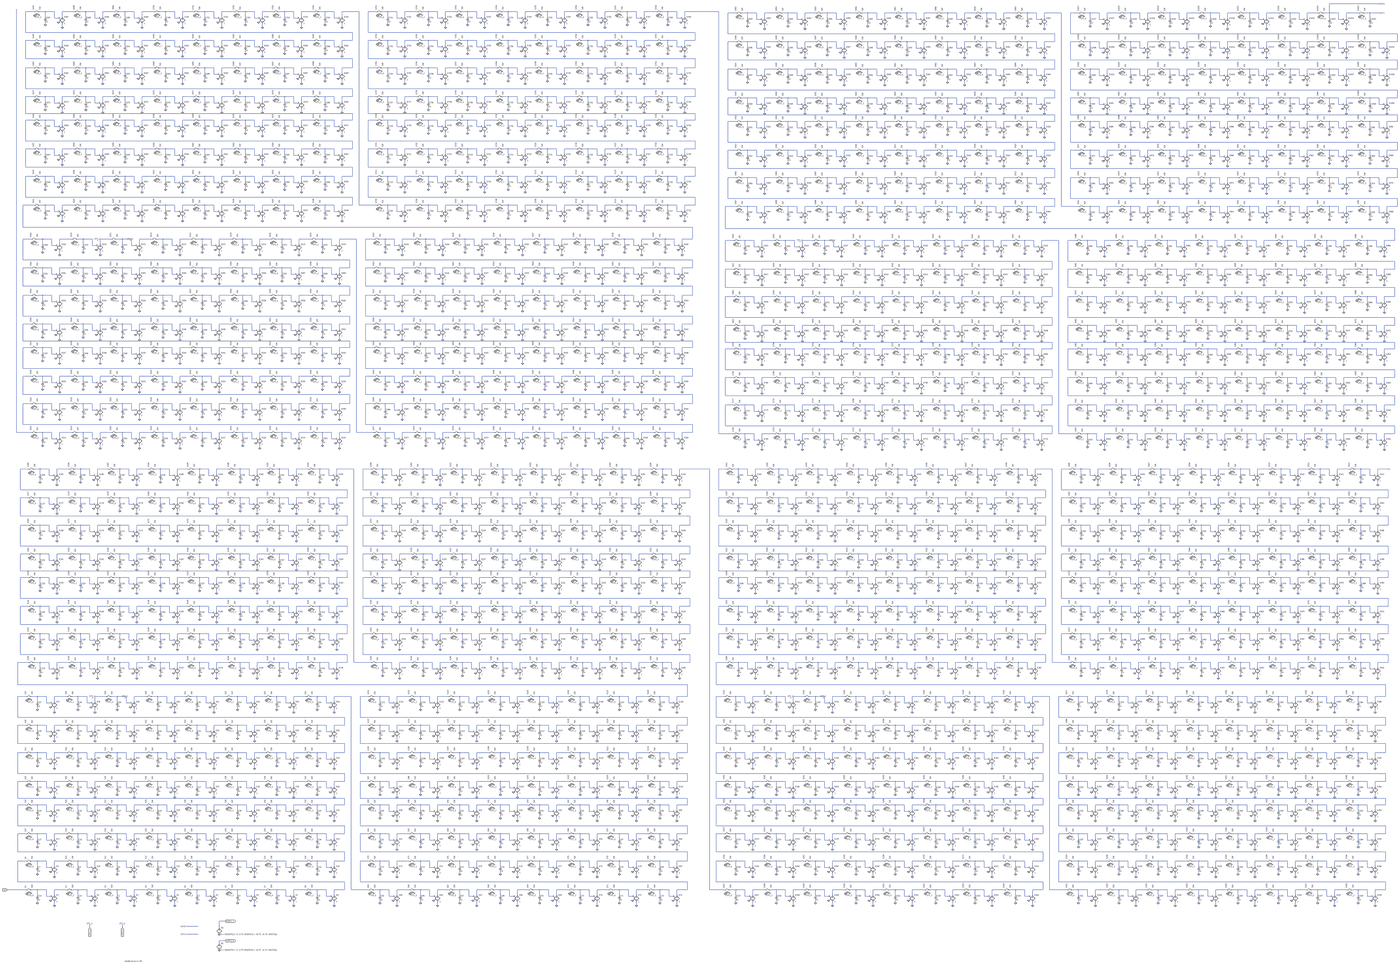
[diagram p0: schematic CHEAP BBD.asc, whole sheet]
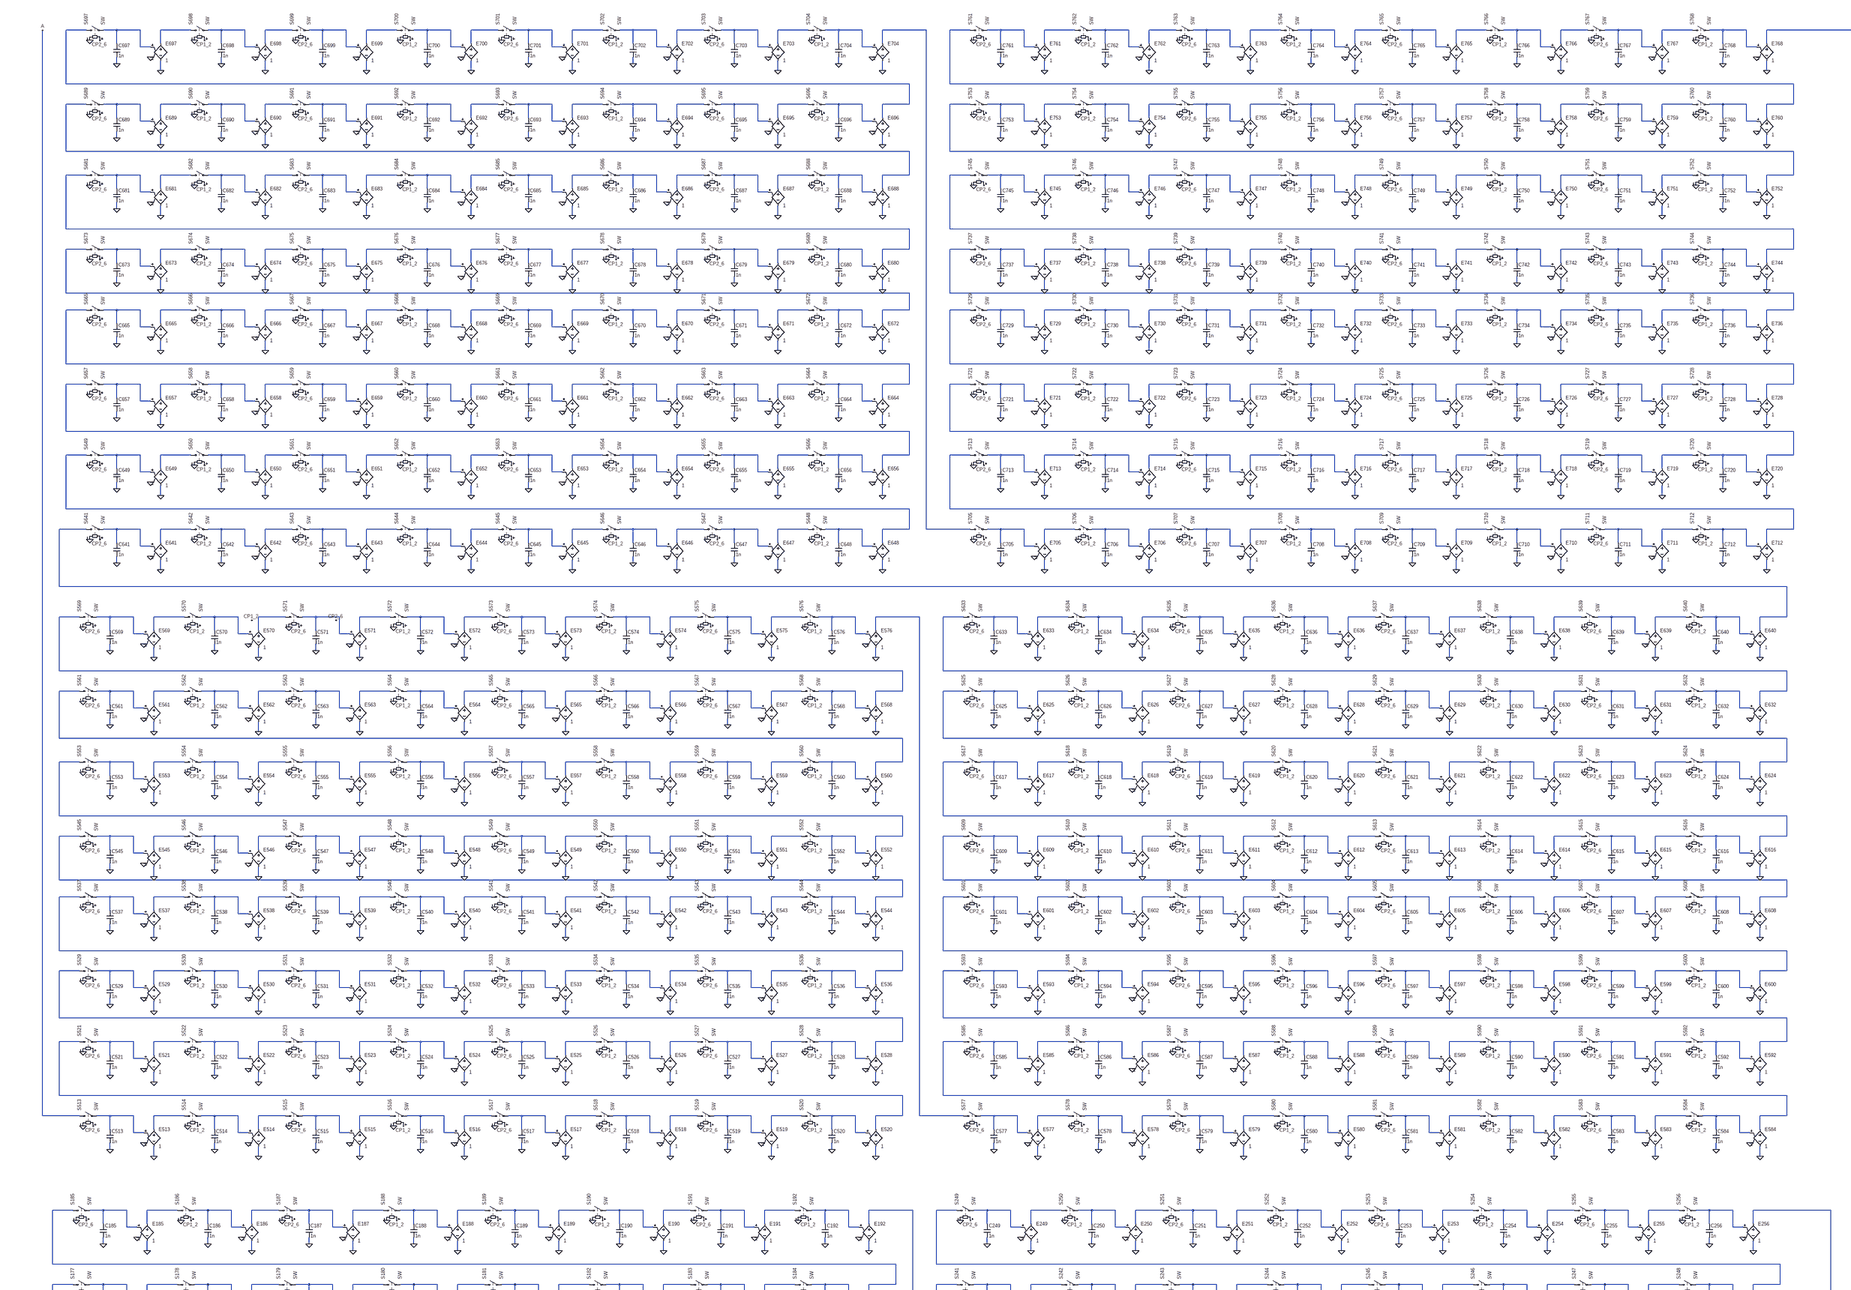
[diagram p1: schematic CHEAP BBD.asc, part, row 1 of 2, column 1 of 2]
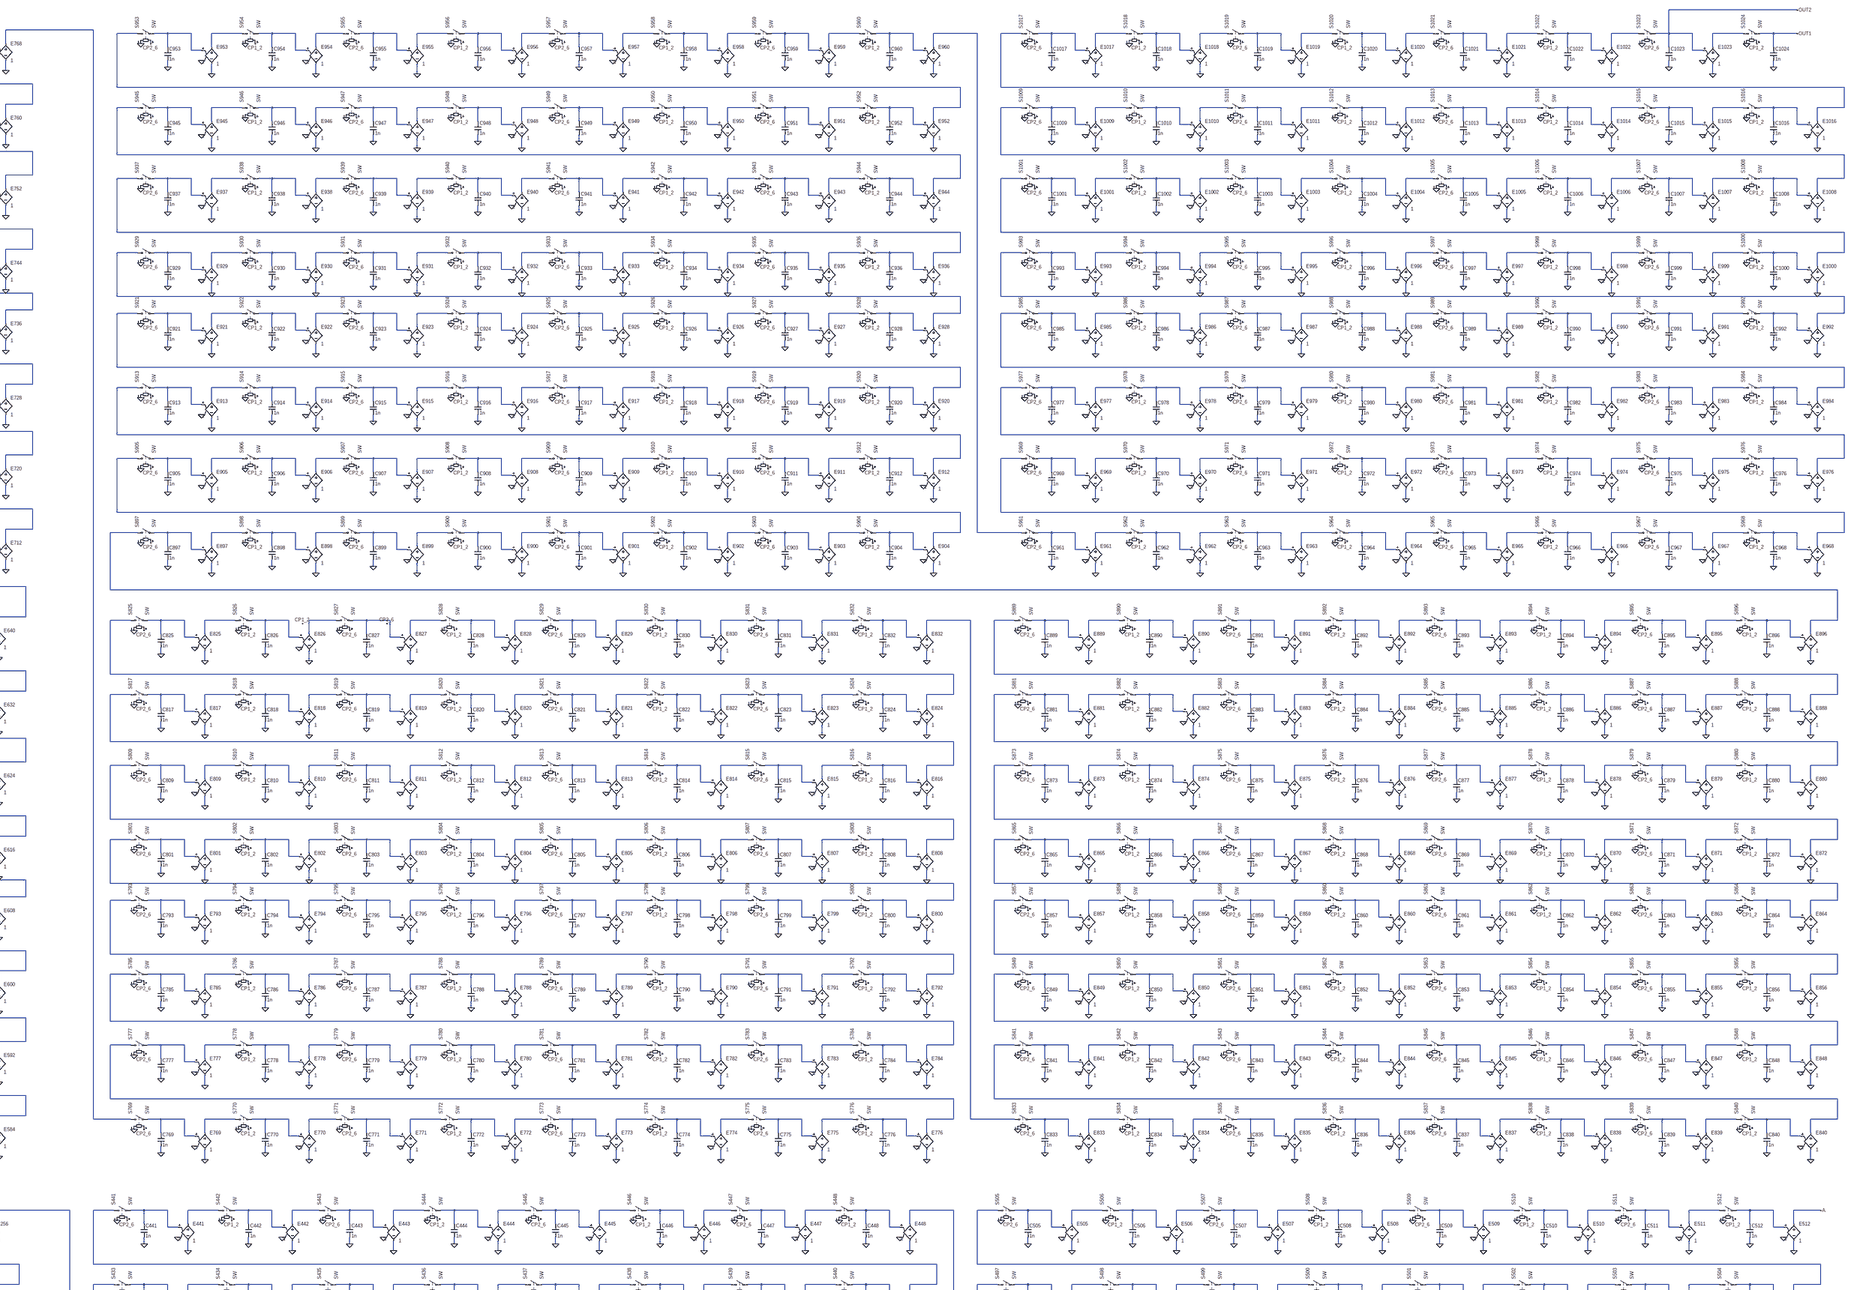
[diagram p2: schematic CHEAP BBD.asc, part, row 1 of 2, column 2 of 2]
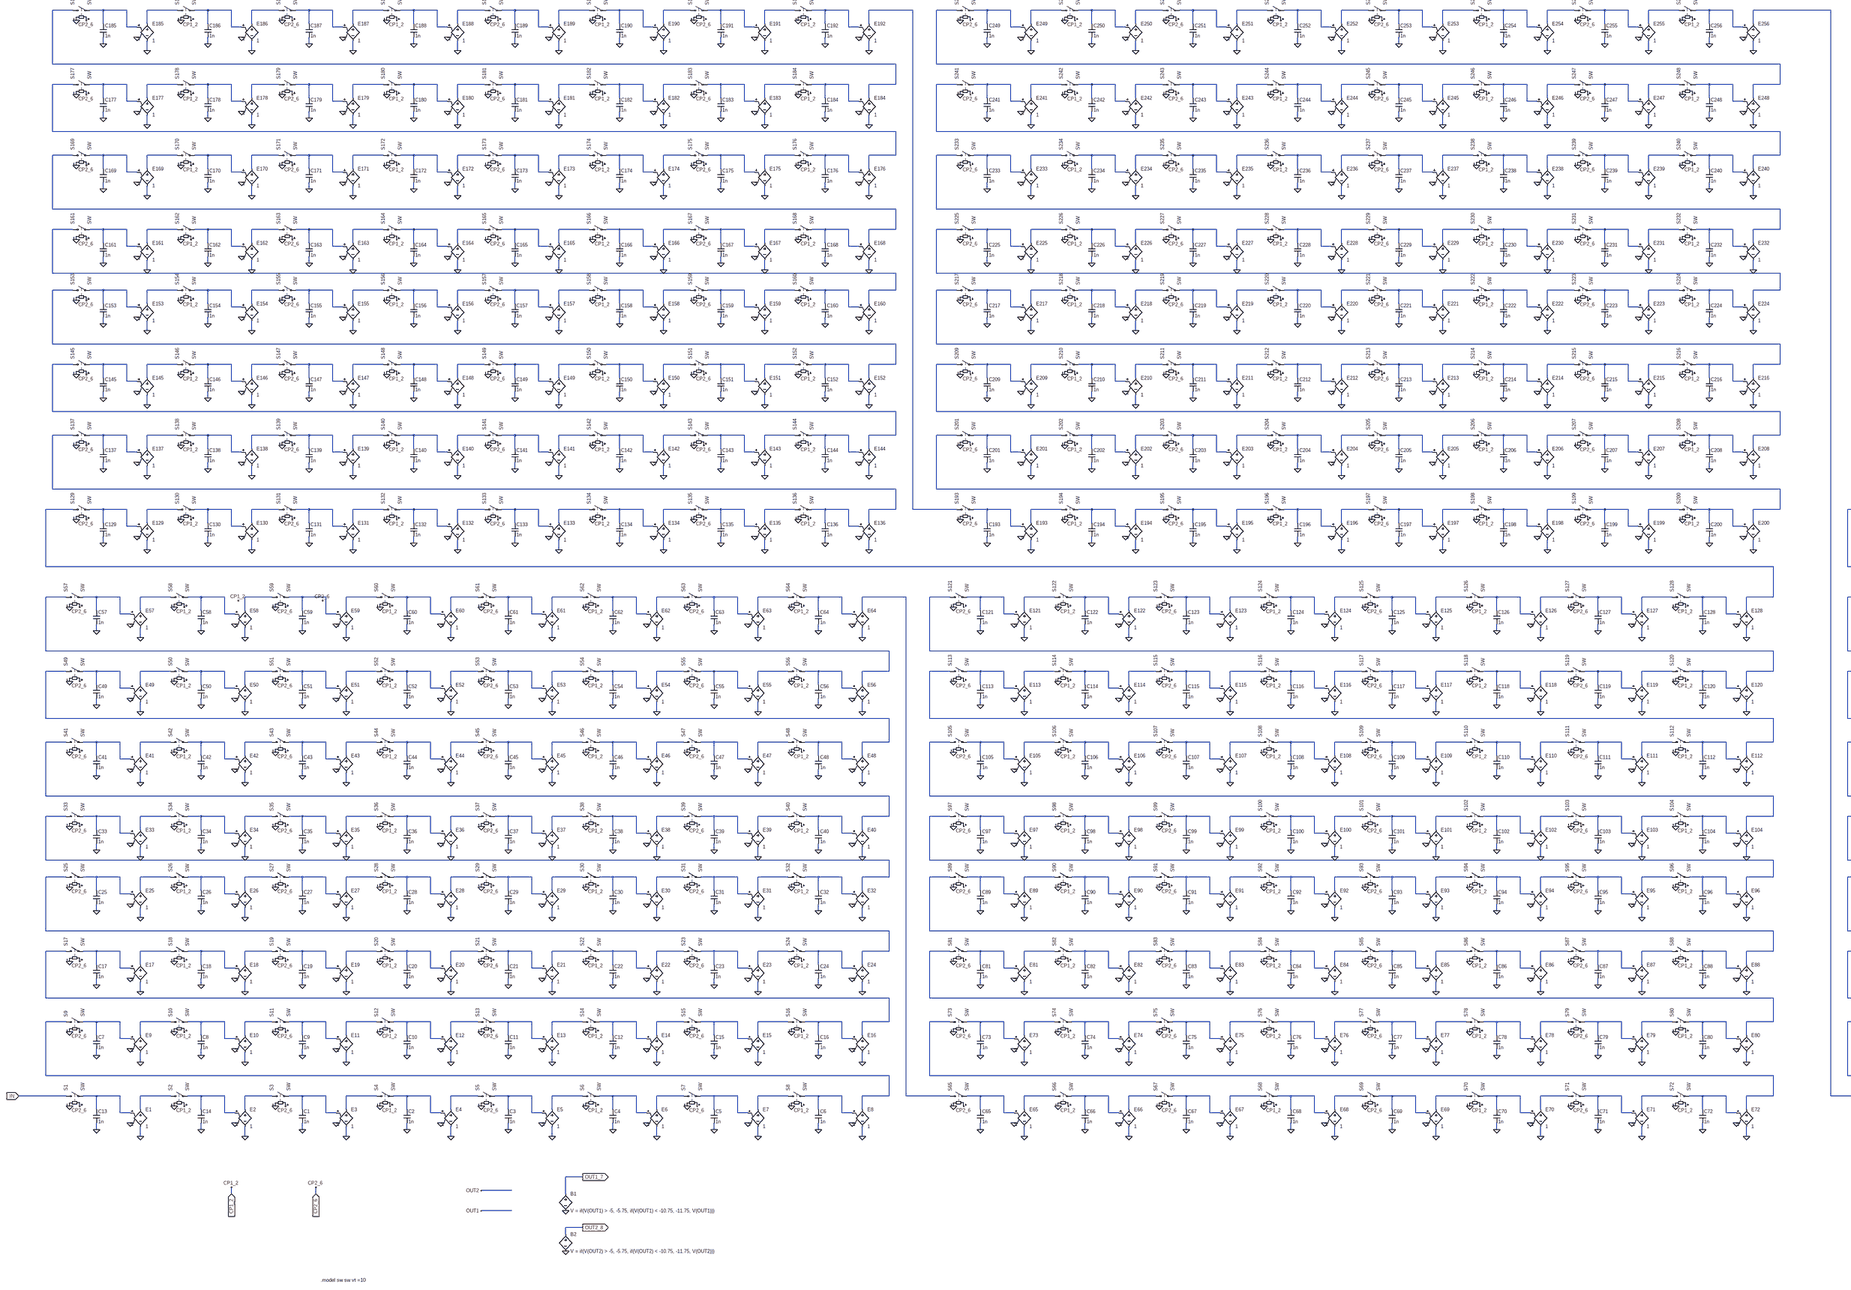
[diagram p3: schematic CHEAP BBD.asc, part, row 2 of 2, column 1 of 2]
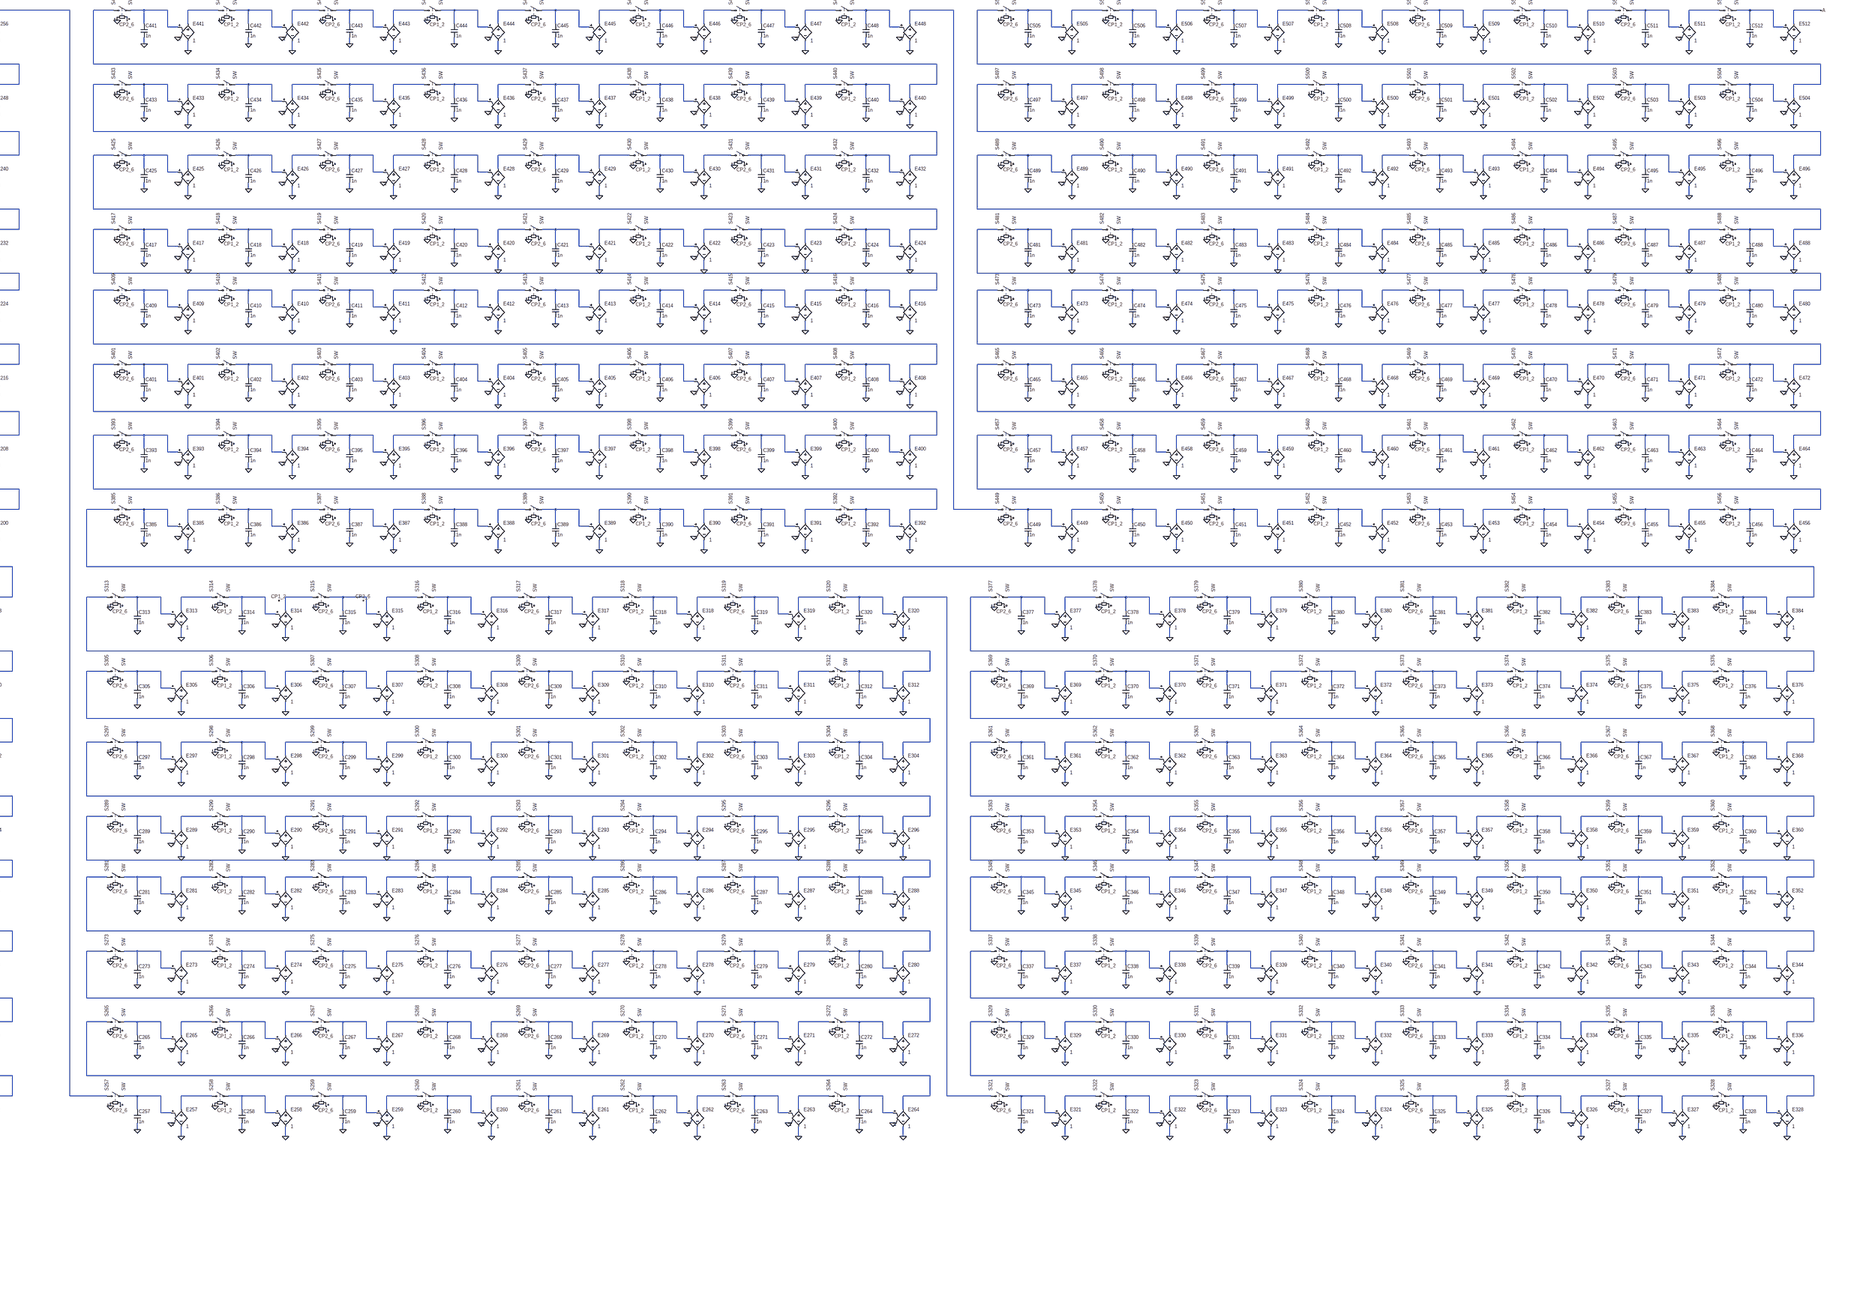
[diagram p4: schematic CHEAP BBD.asc, part, row 2 of 2, column 2 of 2]
* CHEAP BBD.asc
S1 IN N1985 CP2_6 0 SW
C13 N1985 0 1n
S2 N1986 N1987 CP1_2 0 SW
C14 N1987 0 1n
E1 N1986 0 N1985 0 1
E2 N1988 0 N1987 0 1
S3 N1988 N1989 CP2_6 0 SW
C1 N1989 0 1n
S4 N1990 N1991 CP1_2 0 SW
C2 N1991 0 1n
E3 N1990 0 N1989 0 1
E4 N1992 0 N1991 0 1
S5 N1992 N1993 CP2_6 0 SW
C3 N1993 0 1n
S6 N1994 N1995 CP1_2 0 SW
C4 N1995 0 1n
E5 N1994 0 N1993 0 1
E6 N1996 0 N1995 0 1
S7 N1996 N1997 CP2_6 0 SW
C5 N1997 0 1n
S8 N1998 N1999 CP1_2 0 SW
C6 N1999 0 1n
E7 N1998 0 N1997 0 1
E8 N1921 0 N1999 0 1
S9 N1921 N1922 CP2_6 0 SW
C7 N1922 0 1n
S10 N1923 N1924 CP1_2 0 SW
C8 N1924 0 1n
E9 N1923 0 N1922 0 1
E10 N1925 0 N1924 0 1
S11 N1925 N1926 CP2_6 0 SW
C9 N1926 0 1n
S12 N1927 N1928 CP1_2 0 SW
C10 N1928 0 1n
E11 N1927 0 N1926 0 1
E12 N1929 0 N1928 0 1
S13 N1929 N1930 CP2_6 0 SW
C11 N1930 0 1n
S14 N1931 N1932 CP1_2 0 SW
C12 N1932 0 1n
E13 N1931 0 N1930 0 1
E14 N1933 0 N1932 0 1
S15 N1933 N1934 CP2_6 0 SW
C15 N1934 0 1n
S16 N1935 N1936 CP1_2 0 SW
C16 N1936 0 1n
E15 N1935 0 N1934 0 1
E16 N1857 0 N1936 0 1
S17 N1857 N1858 CP2_6 0 SW
C17 N1858 0 1n
S18 N1859 N1860 CP1_2 0 SW
C18 N1860 0 1n
E17 N1859 0 N1858 0 1
E18 N1861 0 N1860 0 1
S19 N1861 N1862 CP2_6 0 SW
C19 N1862 0 1n
S20 N1863 N1864 CP1_2 0 SW
C20 N1864 0 1n
E19 N1863 0 N1862 0 1
E20 N1865 0 N1864 0 1
S21 N1865 N1866 CP2_6 0 SW
C21 N1866 0 1n
S22 N1867 N1868 CP1_2 0 SW
C22 N1868 0 1n
E21 N1867 0 N1866 0 1
E22 N1869 0 N1868 0 1
S23 N1869 N1870 CP2_6 0 SW
C23 N1870 0 1n
S24 N1871 N1872 CP1_2 0 SW
C24 N1872 0 1n
E23 N1871 0 N1870 0 1
E24 N1793 0 N1872 0 1
S25 N1793 N1794 CP2_6 0 SW
C25 N1794 0 1n
S26 N1795 N1796 CP1_2 0 SW
C26 N1796 0 1n
E25 N1795 0 N1794 0 1
E26 N1797 0 N1796 0 1
S27 N1797 N1798 CP2_6 0 SW
C27 N1798 0 1n
S28 N1799 N1800 CP1_2 0 SW
C28 N1800 0 1n
E27 N1799 0 N1798 0 1
E28 N1801 0 N1800 0 1
S29 N1801 N1802 CP2_6 0 SW
C29 N1802 0 1n
S30 N1803 N1804 CP1_2 0 SW
C30 N1804 0 1n
E29 N1803 0 N1802 0 1
E30 N1805 0 N1804 0 1
S31 N1805 N1806 CP2_6 0 SW
C31 N1806 0 1n
S32 N1807 N1808 CP1_2 0 SW
C32 N1808 0 1n
E31 N1807 0 N1806 0 1
E32 N1729 0 N1808 0 1
S33 N1729 N1730 CP2_6 0 SW
C33 N1730 0 1n
S34 N1731 N1732 CP1_2 0 SW
C34 N1732 0 1n
E33 N1731 0 N1730 0 1
E34 N1733 0 N1732 0 1
S35 N1733 N1734 CP2_6 0 SW
C35 N1734 0 1n
S36 N1735 N1736 CP1_2 0 SW
C36 N1736 0 1n
E35 N1735 0 N1734 0 1
E36 N1737 0 N1736 0 1
S37 N1737 N1738 CP2_6 0 SW
C37 N1738 0 1n
S38 N1739 N1740 CP1_2 0 SW
C38 N1740 0 1n
E37 N1739 0 N1738 0 1
E38 N1741 0 N1740 0 1
S39 N1741 N1742 CP2_6 0 SW
C39 N1742 0 1n
S40 N1743 N1744 CP1_2 0 SW
C40 N1744 0 1n
E39 N1743 0 N1742 0 1
E40 N1665 0 N1744 0 1
S41 N1665 N1666 CP2_6 0 SW
C41 N1666 0 1n
S42 N1667 N1668 CP1_2 0 SW
C42 N1668 0 1n
E41 N1667 0 N1666 0 1
E42 N1669 0 N1668 0 1
S43 N1669 N1670 CP2_6 0 SW
C43 N1670 0 1n
S44 N1671 N1672 CP1_2 0 SW
C44 N1672 0 1n
E43 N1671 0 N1670 0 1
E44 N1673 0 N1672 0 1
S45 N1673 N1674 CP2_6 0 SW
C45 N1674 0 1n
S46 N1675 N1676 CP1_2 0 SW
C46 N1676 0 1n
E45 N1675 0 N1674 0 1
E46 N1677 0 N1676 0 1
S47 N1677 N1678 CP2_6 0 SW
C47 N1678 0 1n
S48 N1679 N1680 CP1_2 0 SW
C48 N1680 0 1n
E47 N1679 0 N1678 0 1
E48 N1601 0 N1680 0 1
S49 N1601 N1602 CP2_6 0 SW
C49 N1602 0 1n
S50 N1603 N1604 CP1_2 0 SW
C50 N1604 0 1n
E49 N1603 0 N1602 0 1
E50 N1605 0 N1604 0 1
S51 N1605 N1606 CP2_6 0 SW
C51 N1606 0 1n
S52 N1607 N1608 CP1_2 0 SW
C52 N1608 0 1n
E51 N1607 0 N1606 0 1
E52 N1609 0 N1608 0 1
S53 N1609 N1610 CP2_6 0 SW
C53 N1610 0 1n
S54 N1611 N1612 CP1_2 0 SW
C54 N1612 0 1n
E53 N1611 0 N1610 0 1
E54 N1613 0 N1612 0 1
S55 N1613 N1614 CP2_6 0 SW
C55 N1614 0 1n
S56 N1615 N1616 CP1_2 0 SW
C56 N1616 0 1n
E55 N1615 0 N1614 0 1
E56 N1535 0 N1616 0 1
S57 N1535 N1536 CP2_6 0 SW
C57 N1536 0 1n
S58 N1537 N1538 CP1_2 0 SW
C58 N1538 0 1n
E57 N1537 0 N1536 0 1
E58 N1539 0 N1538 0 1
S59 N1539 N1540 CP2_6 0 SW
C59 N1540 0 1n
S60 N1541 N1542 CP1_2 0 SW
C60 N1542 0 1n
E59 N1541 0 N1540 0 1
E60 N1543 0 N1542 0 1
S61 N1543 N1544 CP2_6 0 SW
C61 N1544 0 1n
S62 N1545 N1546 CP1_2 0 SW
C62 N1546 0 1n
E61 N1545 0 N1544 0 1
E62 N1547 0 N1546 0 1
S63 N1547 N1548 CP2_6 0 SW
C63 N1548 0 1n
S64 N1549 N1550 CP1_2 0 SW
C64 N1550 0 1n
E63 N1549 0 N1548 0 1
E64 N1551 0 N1550 0 1
S65 N1551 N2000 CP2_6 0 SW
C65 N2000 0 1n
S66 N2001 N2002 CP1_2 0 SW
C66 N2002 0 1n
E65 N2001 0 N2000 0 1
E66 N2003 0 N2002 0 1
S67 N2003 N2004 CP2_6 0 SW
C67 N2004 0 1n
S68 N2005 N2006 CP1_2 0 SW
C68 N2006 0 1n
E67 N2005 0 N2004 0 1
E68 N2007 0 N2006 0 1
S69 N2007 N2008 CP2_6 0 SW
C69 N2008 0 1n
S70 N2009 N2010 CP1_2 0 SW
C70 N2010 0 1n
E69 N2009 0 N2008 0 1
E70 N2011 0 N2010 0 1
S71 N2011 N2012 CP2_6 0 SW
C71 N2012 0 1n
S72 N2013 N2014 CP1_2 0 SW
C72 N2014 0 1n
E71 N2013 0 N2012 0 1
E72 N1937 0 N2014 0 1
S73 N1937 N1938 CP2_6 0 SW
C73 N1938 0 1n
S74 N1939 N1940 CP1_2 0 SW
C74 N1940 0 1n
E73 N1939 0 N1938 0 1
E74 N1941 0 N1940 0 1
S75 N1941 N1942 CP2_6 0 SW
C75 N1942 0 1n
S76 N1943 N1944 CP1_2 0 SW
C76 N1944 0 1n
E75 N1943 0 N1942 0 1
E76 N1945 0 N1944 0 1
S77 N1945 N1946 CP2_6 0 SW
C77 N1946 0 1n
S78 N1947 N1948 CP1_2 0 SW
C78 N1948 0 1n
E77 N1947 0 N1946 0 1
E78 N1949 0 N1948 0 1
S79 N1949 N1950 CP2_6 0 SW
C79 N1950 0 1n
S80 N1951 N1952 CP1_2 0 SW
C80 N1952 0 1n
E79 N1951 0 N1950 0 1
E80 N1873 0 N1952 0 1
S81 N1873 N1874 CP2_6 0 SW
C81 N1874 0 1n
S82 N1875 N1876 CP1_2 0 SW
C82 N1876 0 1n
E81 N1875 0 N1874 0 1
E82 N1877 0 N1876 0 1
S83 N1877 N1878 CP2_6 0 SW
C83 N1878 0 1n
S84 N1879 N1880 CP1_2 0 SW
C84 N1880 0 1n
E83 N1879 0 N1878 0 1
E84 N1881 0 N1880 0 1
S85 N1881 N1882 CP2_6 0 SW
C85 N1882 0 1n
S86 N1883 N1884 CP1_2 0 SW
C86 N1884 0 1n
E85 N1883 0 N1882 0 1
E86 N1885 0 N1884 0 1
S87 N1885 N1886 CP2_6 0 SW
C87 N1886 0 1n
S88 N1887 N1888 CP1_2 0 SW
C88 N1888 0 1n
E87 N1887 0 N1886 0 1
E88 N1809 0 N1888 0 1
S89 N1809 N1810 CP2_6 0 SW
C89 N1810 0 1n
S90 N1811 N1812 CP1_2 0 SW
C90 N1812 0 1n
E89 N1811 0 N1810 0 1
E90 N1813 0 N1812 0 1
S91 N1813 N1814 CP2_6 0 SW
C91 N1814 0 1n
S92 N1815 N1816 CP1_2 0 SW
C92 N1816 0 1n
E91 N1815 0 N1814 0 1
E92 N1817 0 N1816 0 1
S93 N1817 N1818 CP2_6 0 SW
C93 N1818 0 1n
S94 N1819 N1820 CP1_2 0 SW
C94 N1820 0 1n
E93 N1819 0 N1818 0 1
E94 N1821 0 N1820 0 1
S95 N1821 N1822 CP2_6 0 SW
C95 N1822 0 1n
S96 N1823 N1824 CP1_2 0 SW
C96 N1824 0 1n
E95 N1823 0 N1822 0 1
E96 N1745 0 N1824 0 1
S97 N1745 N1746 CP2_6 0 SW
C97 N1746 0 1n
S98 N1747 N1748 CP1_2 0 SW
C98 N1748 0 1n
E97 N1747 0 N1746 0 1
E98 N1749 0 N1748 0 1
S99 N1749 N1750 CP2_6 0 SW
C99 N1750 0 1n
S100 N1751 N1752 CP1_2 0 SW
C100 N1752 0 1n
E99 N1751 0 N1750 0 1
E100 N1753 0 N1752 0 1
S101 N1753 N1754 CP2_6 0 SW
C101 N1754 0 1n
S102 N1755 N1756 CP1_2 0 SW
C102 N1756 0 1n
E101 N1755 0 N1754 0 1
E102 N1757 0 N1756 0 1
S103 N1757 N1758 CP2_6 0 SW
C103 N1758 0 1n
S104 N1759 N1760 CP1_2 0 SW
C104 N1760 0 1n
E103 N1759 0 N1758 0 1
E104 N1681 0 N1760 0 1
S105 N1681 N1682 CP2_6 0 SW
C105 N1682 0 1n
S106 N1683 N1684 CP1_2 0 SW
C106 N1684 0 1n
E105 N1683 0 N1682 0 1
E106 N1685 0 N1684 0 1
S107 N1685 N1686 CP2_6 0 SW
C107 N1686 0 1n
S108 N1687 N1688 CP1_2 0 SW
C108 N1688 0 1n
E107 N1687 0 N1686 0 1
E108 N1689 0 N1688 0 1
S109 N1689 N1690 CP2_6 0 SW
C109 N1690 0 1n
S110 N1691 N1692 CP1_2 0 SW
C110 N1692 0 1n
E109 N1691 0 N1690 0 1
E110 N1693 0 N1692 0 1
S111 N1693 N1694 CP2_6 0 SW
C111 N1694 0 1n
S112 N1695 N1696 CP1_2 0 SW
C112 N1696 0 1n
E111 N1695 0 N1694 0 1
E112 N1617 0 N1696 0 1
S113 N1617 N1618 CP2_6 0 SW
C113 N1618 0 1n
S114 N1619 N1620 CP1_2 0 SW
C114 N1620 0 1n
E113 N1619 0 N1618 0 1
E114 N1621 0 N1620 0 1
S115 N1621 N1622 CP2_6 0 SW
C115 N1622 0 1n
S116 N1623 N1624 CP1_2 0 SW
C116 N1624 0 1n
E115 N1623 0 N1622 0 1
E116 N1625 0 N1624 0 1
S117 N1625 N1626 CP2_6 0 SW
C117 N1626 0 1n
S118 N1627 N1628 CP1_2 0 SW
C118 N1628 0 1n
E117 N1627 0 N1626 0 1
E118 N1629 0 N1628 0 1
S119 N1629 N1630 CP2_6 0 SW
C119 N1630 0 1n
S120 N1631 N1632 CP1_2 0 SW
C120 N1632 0 1n
E119 N1631 0 N1630 0 1
E120 N1552 0 N1632 0 1
S121 N1552 N1553 CP2_6 0 SW
C121 N1553 0 1n
S122 N1554 N1555 CP1_2 0 SW
C122 N1555 0 1n
E121 N1554 0 N1553 0 1
E122 N1556 0 N1555 0 1
S123 N1556 N1557 CP2_6 0 SW
C123 N1557 0 1n
S124 N1558 N1559 CP1_2 0 SW
C124 N1559 0 1n
E123 N1558 0 N1557 0 1
E124 N1560 0 N1559 0 1
S125 N1560 N1561 CP2_6 0 SW
C125 N1561 0 1n
S126 N1562 N1563 CP1_2 0 SW
C126 N1563 0 1n
E125 N1562 0 N1561 0 1
E126 N1564 0 N1563 0 1
S127 N1564 N1565 CP2_6 0 SW
C127 N1565 0 1n
S128 N1566 N1567 CP1_2 0 SW
C128 N1567 0 1n
E127 N1566 0 N1565 0 1
E128 N1473 0 N1567 0 1
S129 N1473 N1474 CP2_6 0 SW
C129 N1474 0 1n
S130 N1475 N1476 CP1_2 0 SW
C130 N1476 0 1n
E129 N1475 0 N1474 0 1
E130 N1477 0 N1476 0 1
S131 N1477 N1478 CP2_6 0 SW
C131 N1478 0 1n
S132 N1479 N1480 CP1_2 0 SW
C132 N1480 0 1n
E131 N1479 0 N1478 0 1
E132 N1481 0 N1480 0 1
S133 N1481 N1482 CP2_6 0 SW
C133 N1482 0 1n
S134 N1483 N1484 CP1_2 0 SW
C134 N1484 0 1n
E133 N1483 0 N1482 0 1
E134 N1485 0 N1484 0 1
S135 N1485 N1486 CP2_6 0 SW
C135 N1486 0 1n
S136 N1487 N1488 CP1_2 0 SW
C136 N1488 0 1n
E135 N1487 0 N1486 0 1
E136 N1409 0 N1488 0 1
S137 N1409 N1410 CP2_6 0 SW
C137 N1410 0 1n
S138 N1411 N1412 CP1_2 0 SW
C138 N1412 0 1n
E137 N1411 0 N1410 0 1
E138 N1413 0 N1412 0 1
S139 N1413 N1414 CP2_6 0 SW
C139 N1414 0 1n
S140 N1415 N1416 CP1_2 0 SW
C140 N1416 0 1n
E139 N1415 0 N1414 0 1
E140 N1417 0 N1416 0 1
S141 N1417 N1418 CP2_6 0 SW
C141 N1418 0 1n
S142 N1419 N1420 CP1_2 0 SW
C142 N1420 0 1n
E141 N1419 0 N1418 0 1
E142 N1421 0 N1420 0 1
S143 N1421 N1422 CP2_6 0 SW
C143 N1422 0 1n
S144 N1423 N1424 CP1_2 0 SW
C144 N1424 0 1n
E143 N1423 0 N1422 0 1
E144 N1345 0 N1424 0 1
S145 N1345 N1346 CP2_6 0 SW
C145 N1346 0 1n
S146 N1347 N1348 CP1_2 0 SW
C146 N1348 0 1n
E145 N1347 0 N1346 0 1
E146 N1349 0 N1348 0 1
S147 N1349 N1350 CP2_6 0 SW
C147 N1350 0 1n
S148 N1351 N1352 CP1_2 0 SW
C148 N1352 0 1n
E147 N1351 0 N1350 0 1
E148 N1353 0 N1352 0 1
S149 N1353 N1354 CP2_6 0 SW
C149 N1354 0 1n
S150 N1355 N1356 CP1_2 0 SW
C150 N1356 0 1n
E149 N1355 0 N1354 0 1
E150 N1357 0 N1356 0 1
S151 N1357 N1358 CP2_6 0 SW
C151 N1358 0 1n
S152 N1359 N1360 CP1_2 0 SW
C152 N1360 0 1n
E151 N1359 0 N1358 0 1
E152 N1281 0 N1360 0 1
S153 N1281 N1282 CP2_6 0 SW
C153 N1282 0 1n
S154 N1283 N1284 CP1_2 0 SW
C154 N1284 0 1n
E153 N1283 0 N1282 0 1
E154 N1285 0 N1284 0 1
S155 N1285 N1286 CP2_6 0 SW
C155 N1286 0 1n
S156 N1287 N1288 CP1_2 0 SW
C156 N1288 0 1n
E155 N1287 0 N1286 0 1
E156 N1289 0 N1288 0 1
S157 N1289 N1290 CP2_6 0 SW
C157 N1290 0 1n
S158 N1291 N1292 CP1_2 0 SW
C158 N1292 0 1n
E157 N1291 0 N1290 0 1
E158 N1293 0 N1292 0 1
S159 N1293 N1294 CP2_6 0 SW
C159 N1294 0 1n
S160 N1295 N1296 CP1_2 0 SW
C160 N1296 0 1n
E159 N1295 0 N1294 0 1
E160 N1217 0 N1296 0 1
S161 N1217 N1218 CP2_6 0 SW
C161 N1218 0 1n
S162 N1219 N1220 CP1_2 0 SW
C162 N1220 0 1n
E161 N1219 0 N1218 0 1
E162 N1221 0 N1220 0 1
S163 N1221 N1222 CP2_6 0 SW
C163 N1222 0 1n
S164 N1223 N1224 CP1_2 0 SW
C164 N1224 0 1n
E163 N1223 0 N1222 0 1
E164 N1225 0 N1224 0 1
S165 N1225 N1226 CP2_6 0 SW
C165 N1226 0 1n
S166 N1227 N1228 CP1_2 0 SW
C166 N1228 0 1n
E165 N1227 0 N1226 0 1
E166 N1229 0 N1228 0 1
S167 N1229 N1230 CP2_6 0 SW
C167 N1230 0 1n
S168 N1231 N1232 CP1_2 0 SW
C168 N1232 0 1n
E167 N1231 0 N1230 0 1
E168 N1153 0 N1232 0 1
S169 N1153 N1154 CP2_6 0 SW
C169 N1154 0 1n
S170 N1155 N1156 CP1_2 0 SW
C170 N1156 0 1n
E169 N1155 0 N1154 0 1
E170 N1157 0 N1156 0 1
S171 N1157 N1158 CP2_6 0 SW
C171 N1158 0 1n
S172 N1159 N1160 CP1_2 0 SW
C172 N1160 0 1n
E171 N1159 0 N1158 0 1
E172 N1161 0 N1160 0 1
S173 N1161 N1162 CP2_6 0 SW
C173 N1162 0 1n
S174 N1163 N1164 CP1_2 0 SW
C174 N1164 0 1n
E173 N1163 0 N1162 0 1
E174 N1165 0 N1164 0 1
S175 N1165 N1166 CP2_6 0 SW
C175 N1166 0 1n
S176 N1167 N1168 CP1_2 0 SW
C176 N1168 0 1n
E175 N1167 0 N1166 0 1
E176 N1089 0 N1168 0 1
S177 N1089 N1090 CP2_6 0 SW
C177 N1090 0 1n
S178 N1091 N1092 CP1_2 0 SW
C178 N1092 0 1n
E177 N1091 0 N1090 0 1
E178 N1093 0 N1092 0 1
S179 N1093 N1094 CP2_6 0 SW
C179 N1094 0 1n
S180 N1095 N1096 CP1_2 0 SW
C180 N1096 0 1n
E179 N1095 0 N1094 0 1
E180 N1097 0 N1096 0 1
S181 N1097 N1098 CP2_6 0 SW
C181 N1098 0 1n
S182 N1099 N1100 CP1_2 0 SW
C182 N1100 0 1n
E181 N1099 0 N1098 0 1
E182 N1101 0 N1100 0 1
S183 N1101 N1102 CP2_6 0 SW
C183 N1102 0 1n
S184 N1103 N1104 CP1_2 0 SW
C184 N1104 0 1n
E183 N1103 0 N1102 0 1
E184 N1022 0 N1104 0 1
S185 N1022 N1023 CP2_6 0 SW
C185 N1023 0 1n
S186 N1024 N1025 CP1_2 0 SW
C186 N1025 0 1n
E185 N1024 0 N1023 0 1
E186 N1026 0 N1025 0 1
S187 N1026 N1027 CP2_6 0 SW
C187 N1027 0 1n
S188 N1028 N1029 CP1_2 0 SW
C188 N1029 0 1n
E187 N1028 0 N1027 0 1
E188 N1030 0 N1029 0 1
S189 N1030 N1031 CP2_6 0 SW
C189 N1031 0 1n
S190 N1032 N1033 CP1_2 0 SW
C190 N1033 0 1n
E189 N1032 0 N1031 0 1
E190 N1034 0 N1033 0 1
S191 N1034 N1035 CP2_6 0 SW
C191 N1035 0 1n
S192 N1036 N1037 CP1_2 0 SW
C192 N1037 0 1n
E191 N1036 0 N1035 0 1
E192 N1038 0 N1037 0 1
S193 N1038 N1489 CP2_6 0 SW
C193 N1489 0 1n
S194 N1490 N1491 CP1_2 0 SW
C194 N1491 0 1n
E193 N1490 0 N1489 0 1
E194 N1492 0 N1491 0 1
S195 N1492 N1493 CP2_6 0 SW
C195 N1493 0 1n
S196 N1494 N1495 CP1_2 0 SW
C196 N1495 0 1n
E195 N1494 0 N1493 0 1
E196 N1496 0 N1495 0 1
S197 N1496 N1497 CP2_6 0 SW
C197 N1497 0 1n
S198 N1498 N1499 CP1_2 0 SW
C198 N1499 0 1n
E197 N1498 0 N1497 0 1
E198 N1500 0 N1499 0 1
S199 N1500 N1501 CP2_6 0 SW
C199 N1501 0 1n
S200 N1502 N1503 CP1_2 0 SW
C200 N1503 0 1n
E199 N1502 0 N1501 0 1
E200 N1425 0 N1503 0 1
S201 N1425 N1426 CP2_6 0 SW
C201 N1426 0 1n
S202 N1427 N1428 CP1_2 0 SW
C202 N1428 0 1n
E201 N1427 0 N1426 0 1
E202 N1429 0 N1428 0 1
S203 N1429 N1430 CP2_6 0 SW
C203 N1430 0 1n
S204 N1431 N1432 CP1_2 0 SW
C204 N1432 0 1n
E203 N1431 0 N1430 0 1
E204 N1433 0 N1432 0 1
S205 N1433 N1434 CP2_6 0 SW
C205 N1434 0 1n
S206 N1435 N1436 CP1_2 0 SW
C206 N1436 0 1n
E205 N1435 0 N1434 0 1
E206 N1437 0 N1436 0 1
S207 N1437 N1438 CP2_6 0 SW
C207 N1438 0 1n
S208 N1439 N1440 CP1_2 0 SW
C208 N1440 0 1n
E207 N1439 0 N1438 0 1
E208 N1361 0 N1440 0 1
S209 N1361 N1362 CP2_6 0 SW
C209 N1362 0 1n
S210 N1363 N1364 CP1_2 0 SW
C210 N1364 0 1n
E209 N1363 0 N1362 0 1
E210 N1365 0 N1364 0 1
S211 N1365 N1366 CP2_6 0 SW
C211 N1366 0 1n
S212 N1367 N1368 CP1_2 0 SW
C212 N1368 0 1n
E211 N1367 0 N1366 0 1
E212 N1369 0 N1368 0 1
S213 N1369 N1370 CP2_6 0 SW
C213 N1370 0 1n
S214 N1371 N1372 CP1_2 0 SW
C214 N1372 0 1n
E213 N1371 0 N1370 0 1
E214 N1373 0 N1372 0 1
S215 N1373 N1374 CP2_6 0 SW
C215 N1374 0 1n
S216 N1375 N1376 CP1_2 0 SW
C216 N1376 0 1n
E215 N1375 0 N1374 0 1
E216 N1297 0 N1376 0 1
S217 N1297 N1298 CP2_6 0 SW
C217 N1298 0 1n
S218 N1299 N1300 CP1_2 0 SW
C218 N1300 0 1n
E217 N1299 0 N1298 0 1
E218 N1301 0 N1300 0 1
S219 N1301 N1302 CP2_6 0 SW
C219 N1302 0 1n
S220 N1303 N1304 CP1_2 0 SW
C220 N1304 0 1n
E219 N1303 0 N1302 0 1
E220 N1305 0 N1304 0 1
S221 N1305 N1306 CP2_6 0 SW
C221 N1306 0 1n
S222 N1307 N1308 CP1_2 0 SW
C222 N1308 0 1n
E221 N1307 0 N1306 0 1
E222 N1309 0 N1308 0 1
S223 N1309 N1310 CP2_6 0 SW
C223 N1310 0 1n
S224 N1311 N1312 CP1_2 0 SW
C224 N1312 0 1n
E223 N1311 0 N1310 0 1
E224 N1233 0 N1312 0 1
S225 N1233 N1234 CP2_6 0 SW
C225 N1234 0 1n
S226 N1235 N1236 CP1_2 0 SW
C226 N1236 0 1n
E225 N1235 0 N1234 0 1
E226 N1237 0 N1236 0 1
S227 N1237 N1238 CP2_6 0 SW
C227 N1238 0 1n
S228 N1239 N1240 CP1_2 0 SW
C228 N1240 0 1n
E227 N1239 0 N1238 0 1
E228 N1241 0 N1240 0 1
S229 N1241 N1242 CP2_6 0 SW
C229 N1242 0 1n
S230 N1243 N1244 CP1_2 0 SW
C230 N1244 0 1n
E229 N1243 0 N1242 0 1
E230 N1245 0 N1244 0 1
S231 N1245 N1246 CP2_6 0 SW
C231 N1246 0 1n
S232 N1247 N1248 CP1_2 0 SW
C232 N1248 0 1n
E231 N1247 0 N1246 0 1
E232 N1169 0 N1248 0 1
S233 N1169 N1170 CP2_6 0 SW
C233 N1170 0 1n
S234 N1171 N1172 CP1_2 0 SW
C234 N1172 0 1n
E233 N1171 0 N1170 0 1
E234 N1173 0 N1172 0 1
S235 N1173 N1174 CP2_6 0 SW
C235 N1174 0 1n
S236 N1175 N1176 CP1_2 0 SW
C236 N1176 0 1n
E235 N1175 0 N1174 0 1
E236 N1177 0 N1176 0 1
S237 N1177 N1178 CP2_6 0 SW
C237 N1178 0 1n
S238 N1179 N1180 CP1_2 0 SW
C238 N1180 0 1n
E237 N1179 0 N1178 0 1
E238 N1181 0 N1180 0 1
S239 N1181 N1182 CP2_6 0 SW
C239 N1182 0 1n
S240 N1183 N1184 CP1_2 0 SW
C240 N1184 0 1n
E239 N1183 0 N1182 0 1
E240 N1105 0 N1184 0 1
S241 N1105 N1106 CP2_6 0 SW
C241 N1106 0 1n
S242 N1107 N1108 CP1_2 0 SW
C242 N1108 0 1n
E241 N1107 0 N1106 0 1
E242 N1109 0 N1108 0 1
S243 N1109 N1110 CP2_6 0 SW
C243 N1110 0 1n
S244 N1111 N1112 CP1_2 0 SW
C244 N1112 0 1n
E243 N1111 0 N1110 0 1
E244 N1113 0 N1112 0 1
S245 N1113 N1114 CP2_6 0 SW
C245 N1114 0 1n
S246 N1115 N1116 CP1_2 0 SW
C246 N1116 0 1n
E245 N1115 0 N1114 0 1
E246 N1117 0 N1116 0 1
S247 N1117 N1118 CP2_6 0 SW
C247 N1118 0 1n
S248 N1119 N1120 CP1_2 0 SW
C248 N1120 0 1n
E247 N1119 0 N1118 0 1
E248 N1039 0 N1120 0 1
S249 N1039 N1040 CP2_6 0 SW
C249 N1040 0 1n
S250 N1041 N1042 CP1_2 0 SW
C250 N1042 0 1n
E249 N1041 0 N1040 0 1
E250 N1043 0 N1042 0 1
S251 N1043 N1044 CP2_6 0 SW
C251 N1044 0 1n
S252 N1045 N1046 CP1_2 0 SW
C252 N1046 0 1n
E251 N1045 0 N1044 0 1
E252 N1047 0 N1046 0 1
S253 N1047 N1048 CP2_6 0 SW
C253 N1048 0 1n
S254 N1049 N1050 CP1_2 0 SW
C254 N1050 0 1n
E253 N1049 0 N1048 0 1
E254 N1051 0 N1050 0 1
S255 N1051 N1052 CP2_6 0 SW
C255 N1052 0 1n
S256 N1053 N1054 CP1_2 0 SW
C256 N1054 0 1n
E255 N1053 0 N1052 0 1
E256 N1055 0 N1054 0 1
S257 N1055 N2015 CP2_6 0 SW
C257 N2015 0 1n
S258 N2016 N2017 CP1_2 0 SW
C258 N2017 0 1n
E257 N2016 0 N2015 0 1
E258 N2018 0 N2017 0 1
S259 N2018 N2019 CP2_6 0 SW
C259 N2019 0 1n
S260 N2020 N2021 CP1_2 0 SW
C260 N2021 0 1n
E259 N2020 0 N2019 0 1
E260 N2022 0 N2021 0 1
S261 N2022 N2023 CP2_6 0 SW
C261 N2023 0 1n
S262 N2024 N2025 CP1_2 0 SW
C262 N2025 0 1n
E261 N2024 0 N2023 0 1
E262 N2026 0 N2025 0 1
S263 N2026 N2027 CP2_6 0 SW
C263 N2027 0 1n
S264 N2028 N2029 CP1_2 0 SW
C264 N2029 0 1n
E263 N2028 0 N2027 0 1
E264 N1953 0 N2029 0 1
S265 N1953 N1954 CP2_6 0 SW
C265 N1954 0 1n
S266 N1955 N1956 CP1_2 0 SW
C266 N1956 0 1n
E265 N1955 0 N1954 0 1
E266 N1957 0 N1956 0 1
S267 N1957 N1958 CP2_6 0 SW
C267 N1958 0 1n
S268 N1959 N1960 CP1_2 0 SW
C268 N1960 0 1n
E267 N1959 0 N1958 0 1
E268 N1961 0 N1960 0 1
S269 N1961 N1962 CP2_6 0 SW
C269 N1962 0 1n
S270 N1963 N1964 CP1_2 0 SW
C270 N1964 0 1n
E269 N1963 0 N1962 0 1
E270 N1965 0 N1964 0 1
S271 N1965 N1966 CP2_6 0 SW
C271 N1966 0 1n
S272 N1967 N1968 CP1_2 0 SW
C272 N1968 0 1n
E271 N1967 0 N1966 0 1
E272 N1889 0 N1968 0 1
S273 N1889 N1890 CP2_6 0 SW
C273 N1890 0 1n
S274 N1891 N1892 CP1_2 0 SW
C274 N1892 0 1n
E273 N1891 0 N1890 0 1
E274 N1893 0 N1892 0 1
S275 N1893 N1894 CP2_6 0 SW
C275 N1894 0 1n
S276 N1895 N1896 CP1_2 0 SW
C276 N1896 0 1n
E275 N1895 0 N1894 0 1
E276 N1897 0 N1896 0 1
S277 N1897 N1898 CP2_6 0 SW
C277 N1898 0 1n
S278 N1899 N1900 CP1_2 0 SW
C278 N1900 0 1n
E277 N1899 0 N1898 0 1
E278 N1901 0 N1900 0 1
S279 N1901 N1902 CP2_6 0 SW
C279 N1902 0 1n
S280 N1903 N1904 CP1_2 0 SW
C280 N1904 0 1n
E279 N1903 0 N1902 0 1
E280 N1825 0 N1904 0 1
S281 N1825 N1826 CP2_6 0 SW
C281 N1826 0 1n
S282 N1827 N1828 CP1_2 0 SW
C282 N1828 0 1n
E281 N1827 0 N1826 0 1
E282 N1829 0 N1828 0 1
S283 N1829 N1830 CP2_6 0 SW
C283 N1830 0 1n
S284 N1831 N1832 CP1_2 0 SW
C284 N1832 0 1n
E283 N1831 0 N1830 0 1
E284 N1833 0 N1832 0 1
S285 N1833 N1834 CP2_6 0 SW
C285 N1834 0 1n
S286 N1835 N1836 CP1_2 0 SW
C286 N1836 0 1n
E285 N1835 0 N1834 0 1
E286 N1837 0 N1836 0 1
S287 N1837 N1838 CP2_6 0 SW
C287 N1838 0 1n
S288 N1839 N1840 CP1_2 0 SW
C288 N1840 0 1n
E287 N1839 0 N1838 0 1
E288 N1761 0 N1840 0 1
S289 N1761 N1762 CP2_6 0 SW
C289 N1762 0 1n
S290 N1763 N1764 CP1_2 0 SW
C290 N1764 0 1n
E289 N1763 0 N1762 0 1
E290 N1765 0 N1764 0 1
S291 N1765 N1766 CP2_6 0 SW
C291 N1766 0 1n
S292 N1767 N1768 CP1_2 0 SW
C292 N1768 0 1n
E291 N1767 0 N1766 0 1
E292 N1769 0 N1768 0 1
S293 N1769 N1770 CP2_6 0 SW
C293 N1770 0 1n
S294 N1771 N1772 CP1_2 0 SW
C294 N1772 0 1n
E293 N1771 0 N1770 0 1
E294 N1773 0 N1772 0 1
S295 N1773 N1774 CP2_6 0 SW
C295 N1774 0 1n
S296 N1775 N1776 CP1_2 0 SW
C296 N1776 0 1n
E295 N1775 0 N1774 0 1
E296 N1697 0 N1776 0 1
S297 N1697 N1698 CP2_6 0 SW
C297 N1698 0 1n
S298 N1699 N1700 CP1_2 0 SW
C298 N1700 0 1n
E297 N1699 0 N1698 0 1
E298 N1701 0 N1700 0 1
S299 N1701 N1702 CP2_6 0 SW
C299 N1702 0 1n
S300 N1703 N1704 CP1_2 0 SW
C300 N1704 0 1n
E299 N1703 0 N1702 0 1
E300 N1705 0 N1704 0 1
S301 N1705 N1706 CP2_6 0 SW
C301 N1706 0 1n
S302 N1707 N1708 CP1_2 0 SW
C302 N1708 0 1n
E301 N1707 0 N1706 0 1
E302 N1709 0 N1708 0 1
S303 N1709 N1710 CP2_6 0 SW
C303 N1710 0 1n
S304 N1711 N1712 CP1_2 0 SW
C304 N1712 0 1n
E303 N1711 0 N1710 0 1
E304 N1633 0 N1712 0 1
S305 N1633 N1634 CP2_6 0 SW
C305 N1634 0 1n
S306 N1635 N1636 CP1_2 0 SW
C306 N1636 0 1n
E305 N1635 0 N1634 0 1
E306 N1637 0 N1636 0 1
S307 N1637 N1638 CP2_6 0 SW
C307 N1638 0 1n
S308 N1639 N1640 CP1_2 0 SW
C308 N1640 0 1n
E307 N1639 0 N1638 0 1
E308 N1641 0 N1640 0 1
S309 N1641 N1642 CP2_6 0 SW
C309 N1642 0 1n
S310 N1643 N1644 CP1_2 0 SW
C310 N1644 0 1n
E309 N1643 0 N1642 0 1
E310 N1645 0 N1644 0 1
S311 N1645 N1646 CP2_6 0 SW
C311 N1646 0 1n
S312 N1647 N1648 CP1_2 0 SW
C312 N1648 0 1n
E311 N1647 0 N1646 0 1
E312 N1568 0 N1648 0 1
S313 N1568 N1569 CP2_6 0 SW
C313 N1569 0 1n
S314 N1570 N1571 CP1_2 0 SW
C314 N1571 0 1n
E313 N1570 0 N1569 0 1
E314 N1572 0 N1571 0 1
S315 N1572 N1573 CP2_6 0 SW
C315 N1573 0 1n
S316 N1574 N1575 CP1_2 0 SW
C316 N1575 0 1n
E315 N1574 0 N1573 0 1
E316 N1576 0 N1575 0 1
S317 N1576 N1577 CP2_6 0 SW
C317 N1577 0 1n
S318 N1578 N1579 CP1_2 0 SW
C318 N1579 0 1n
E317 N1578 0 N1577 0 1
E318 N1580 0 N1579 0 1
S319 N1580 N1581 CP2_6 0 SW
C319 N1581 0 1n
S320 N1582 N1583 CP1_2 0 SW
C320 N1583 0 1n
E319 N1582 0 N1581 0 1
E320 N1584 0 N1583 0 1
S321 N1584 N2030 CP2_6 0 SW
C321 N2030 0 1n
S322 N2031 N2032 CP1_2 0 SW
C322 N2032 0 1n
E321 N2031 0 N2030 0 1
E322 N2033 0 N2032 0 1
S323 N2033 N2034 CP2_6 0 SW
C323 N2034 0 1n
S324 N2035 N2036 CP1_2 0 SW
C324 N2036 0 1n
E323 N2035 0 N2034 0 1
E324 N2037 0 N2036 0 1
S325 N2037 N2038 CP2_6 0 SW
C325 N2038 0 1n
S326 N2039 N2040 CP1_2 0 SW
C326 N2040 0 1n
E325 N2039 0 N2038 0 1
E326 N2041 0 N2040 0 1
S327 N2041 N2042 CP2_6 0 SW
C327 N2042 0 1n
S328 N2043 N2044 CP1_2 0 SW
C328 N2044 0 1n
E327 N2043 0 N2042 0 1
E328 N1969 0 N2044 0 1
S329 N1969 N1970 CP2_6 0 SW
C329 N1970 0 1n
S330 N1971 N1972 CP1_2 0 SW
C330 N1972 0 1n
E329 N1971 0 N1970 0 1
E330 N1973 0 N1972 0 1
S331 N1973 N1974 CP2_6 0 SW
C331 N1974 0 1n
S332 N1975 N1976 CP1_2 0 SW
C332 N1976 0 1n
E331 N1975 0 N1974 0 1
E332 N1977 0 N1976 0 1
S333 N1977 N1978 CP2_6 0 SW
C333 N1978 0 1n
S334 N1979 N1980 CP1_2 0 SW
C334 N1980 0 1n
E333 N1979 0 N1978 0 1
E334 N1981 0 N1980 0 1
S335 N1981 N1982 CP2_6 0 SW
C335 N1982 0 1n
S336 N1983 N1984 CP1_2 0 SW
C336 N1984 0 1n
E335 N1983 0 N1982 0 1
E336 N1905 0 N1984 0 1
S337 N1905 N1906 CP2_6 0 SW
C337 N1906 0 1n
S338 N1907 N1908 CP1_2 0 SW
C338 N1908 0 1n
E337 N1907 0 N1906 0 1
E338 N1909 0 N1908 0 1
S339 N1909 N1910 CP2_6 0 SW
C339 N1910 0 1n
S340 N1911 N1912 CP1_2 0 SW
C340 N1912 0 1n
E339 N1911 0 N1910 0 1
E340 N1913 0 N1912 0 1
S341 N1913 N1914 CP2_6 0 SW
C341 N1914 0 1n
S342 N1915 N1916 CP1_2 0 SW
C342 N1916 0 1n
E341 N1915 0 N1914 0 1
E342 N1917 0 N1916 0 1
S343 N1917 N1918 CP2_6 0 SW
C343 N1918 0 1n
S344 N1919 N1920 CP1_2 0 SW
C344 N1920 0 1n
E343 N1919 0 N1918 0 1
E344 N1841 0 N1920 0 1
S345 N1841 N1842 CP2_6 0 SW
C345 N1842 0 1n
S346 N1843 N1844 CP1_2 0 SW
C346 N1844 0 1n
E345 N1843 0 N1842 0 1
E346 N1845 0 N1844 0 1
S347 N1845 N1846 CP2_6 0 SW
C347 N1846 0 1n
S348 N1847 N1848 CP1_2 0 SW
C348 N1848 0 1n
E347 N1847 0 N1846 0 1
E348 N1849 0 N1848 0 1
S349 N1849 N1850 CP2_6 0 SW
C349 N1850 0 1n
S350 N1851 N1852 CP1_2 0 SW
C350 N1852 0 1n
E349 N1851 0 N1850 0 1
E350 N1853 0 N1852 0 1
S351 N1853 N1854 CP2_6 0 SW
C351 N1854 0 1n
S352 N1855 N1856 CP1_2 0 SW
C352 N1856 0 1n
E351 N1855 0 N1854 0 1
E352 N1777 0 N1856 0 1
S353 N1777 N1778 CP2_6 0 SW
C353 N1778 0 1n
S354 N1779 N1780 CP1_2 0 SW
C354 N1780 0 1n
E353 N1779 0 N1778 0 1
E354 N1781 0 N1780 0 1
S355 N1781 N1782 CP2_6 0 SW
C355 N1782 0 1n
S356 N1783 N1784 CP1_2 0 SW
C356 N1784 0 1n
E355 N1783 0 N1782 0 1
E356 N1785 0 N1784 0 1
S357 N1785 N1786 CP2_6 0 SW
C357 N1786 0 1n
S358 N1787 N1788 CP1_2 0 SW
C358 N1788 0 1n
E357 N1787 0 N1786 0 1
E358 N1789 0 N1788 0 1
S359 N1789 N1790 CP2_6 0 SW
C359 N1790 0 1n
S360 N1791 N1792 CP1_2 0 SW
C360 N1792 0 1n
E359 N1791 0 N1790 0 1
E360 N1713 0 N1792 0 1
S361 N1713 N1714 CP2_6 0 SW
C361 N1714 0 1n
S362 N1715 N1716 CP1_2 0 SW
C362 N1716 0 1n
E361 N1715 0 N1714 0 1
E362 N1717 0 N1716 0 1
S363 N1717 N1718 CP2_6 0 SW
C363 N1718 0 1n
S364 N1719 N1720 CP1_2 0 SW
C364 N1720 0 1n
E363 N1719 0 N1718 0 1
E364 N1721 0 N1720 0 1
S365 N1721 N1722 CP2_6 0 SW
C365 N1722 0 1n
S366 N1723 N1724 CP1_2 0 SW
C366 N1724 0 1n
E365 N1723 0 N1722 0 1
E366 N1725 0 N1724 0 1
S367 N1725 N1726 CP2_6 0 SW
C367 N1726 0 1n
S368 N1727 N1728 CP1_2 0 SW
C368 N1728 0 1n
E367 N1727 0 N1726 0 1
E368 N1649 0 N1728 0 1
S369 N1649 N1650 CP2_6 0 SW
C369 N1650 0 1n
S370 N1651 N1652 CP1_2 0 SW
C370 N1652 0 1n
E369 N1651 0 N1650 0 1
E370 N1653 0 N1652 0 1
S371 N1653 N1654 CP2_6 0 SW
C371 N1654 0 1n
S372 N1655 N1656 CP1_2 0 SW
C372 N1656 0 1n
E371 N1655 0 N1654 0 1
E372 N1657 0 N1656 0 1
S373 N1657 N1658 CP2_6 0 SW
C373 N1658 0 1n
S374 N1659 N1660 CP1_2 0 SW
C374 N1660 0 1n
E373 N1659 0 N1658 0 1
E374 N1661 0 N1660 0 1
S375 N1661 N1662 CP2_6 0 SW
C375 N1662 0 1n
S376 N1663 N1664 CP1_2 0 SW
C376 N1664 0 1n
E375 N1663 0 N1662 0 1
E376 N1585 0 N1664 0 1
S377 N1585 N1586 CP2_6 0 SW
C377 N1586 0 1n
S378 N1587 N1588 CP1_2 0 SW
C378 N1588 0 1n
E377 N1587 0 N1586 0 1
E378 N1589 0 N1588 0 1
S379 N1589 N1590 CP2_6 0 SW
C379 N1590 0 1n
S380 N1591 N1592 CP1_2 0 SW
C380 N1592 0 1n
E379 N1591 0 N1590 0 1
E380 N1593 0 N1592 0 1
S381 N1593 N1594 CP2_6 0 SW
C381 N1594 0 1n
S382 N1595 N1596 CP1_2 0 SW
C382 N1596 0 1n
E381 N1595 0 N1594 0 1
E382 N1597 0 N1596 0 1
S383 N1597 N1598 CP2_6 0 SW
C383 N1598 0 1n
S384 N1599 N1600 CP1_2 0 SW
C384 N1600 0 1n
E383 N1599 0 N1598 0 1
E384 N1504 0 N1600 0 1
S385 N1504 N1505 CP2_6 0 SW
C385 N1505 0 1n
S386 N1506 N1507 CP1_2 0 SW
C386 N1507 0 1n
E385 N1506 0 N1505 0 1
E386 N1508 0 N1507 0 1
S387 N1508 N1509 CP2_6 0 SW
C387 N1509 0 1n
S388 N1510 N1511 CP1_2 0 SW
C388 N1511 0 1n
E387 N1510 0 N1509 0 1
E388 N1512 0 N1511 0 1
S389 N1512 N1513 CP2_6 0 SW
C389 N1513 0 1n
S390 N1514 N1515 CP1_2 0 SW
C390 N1515 0 1n
E389 N1514 0 N1513 0 1
E390 N1516 0 N1515 0 1
S391 N1516 N1517 CP2_6 0 SW
C391 N1517 0 1n
S392 N1518 N1519 CP1_2 0 SW
C392 N1519 0 1n
E391 N1518 0 N1517 0 1
E392 N1441 0 N1519 0 1
S393 N1441 N1442 CP2_6 0 SW
C393 N1442 0 1n
S394 N1443 N1444 CP1_2 0 SW
C394 N1444 0 1n
E393 N1443 0 N1442 0 1
E394 N1445 0 N1444 0 1
S395 N1445 N1446 CP2_6 0 SW
C395 N1446 0 1n
S396 N1447 N1448 CP1_2 0 SW
C396 N1448 0 1n
E395 N1447 0 N1446 0 1
E396 N1449 0 N1448 0 1
S397 N1449 N1450 CP2_6 0 SW
C397 N1450 0 1n
S398 N1451 N1452 CP1_2 0 SW
C398 N1452 0 1n
E397 N1451 0 N1450 0 1
E398 N1453 0 N1452 0 1
S399 N1453 N1454 CP2_6 0 SW
C399 N1454 0 1n
S400 N1455 N1456 CP1_2 0 SW
C400 N1456 0 1n
E399 N1455 0 N1454 0 1
E400 N1377 0 N1456 0 1
S401 N1377 N1378 CP2_6 0 SW
C401 N1378 0 1n
S402 N1379 N1380 CP1_2 0 SW
C402 N1380 0 1n
E401 N1379 0 N1378 0 1
E402 N1381 0 N1380 0 1
S403 N1381 N1382 CP2_6 0 SW
C403 N1382 0 1n
S404 N1383 N1384 CP1_2 0 SW
C404 N1384 0 1n
E403 N1383 0 N1382 0 1
E404 N1385 0 N1384 0 1
S405 N1385 N1386 CP2_6 0 SW
C405 N1386 0 1n
S406 N1387 N1388 CP1_2 0 SW
C406 N1388 0 1n
E405 N1387 0 N1386 0 1
E406 N1389 0 N1388 0 1
S407 N1389 N1390 CP2_6 0 SW
C407 N1390 0 1n
S408 N1391 N1392 CP1_2 0 SW
C408 N1392 0 1n
E407 N1391 0 N1390 0 1
E408 N1313 0 N1392 0 1
S409 N1313 N1314 CP2_6 0 SW
C409 N1314 0 1n
S410 N1315 N1316 CP1_2 0 SW
C410 N1316 0 1n
E409 N1315 0 N1314 0 1
E410 N1317 0 N1316 0 1
S411 N1317 N1318 CP2_6 0 SW
C411 N1318 0 1n
S412 N1319 N1320 CP1_2 0 SW
C412 N1320 0 1n
E411 N1319 0 N1318 0 1
E412 N1321 0 N1320 0 1
S413 N1321 N1322 CP2_6 0 SW
C413 N1322 0 1n
S414 N1323 N1324 CP1_2 0 SW
C414 N1324 0 1n
E413 N1323 0 N1322 0 1
E414 N1325 0 N1324 0 1
S415 N1325 N1326 CP2_6 0 SW
C415 N1326 0 1n
S416 N1327 N1328 CP1_2 0 SW
C416 N1328 0 1n
E415 N1327 0 N1326 0 1
E416 N1249 0 N1328 0 1
S417 N1249 N1250 CP2_6 0 SW
C417 N1250 0 1n
S418 N1251 N1252 CP1_2 0 SW
C418 N1252 0 1n
E417 N1251 0 N1250 0 1
E418 N1253 0 N1252 0 1
S419 N1253 N1254 CP2_6 0 SW
C419 N1254 0 1n
S420 N1255 N1256 CP1_2 0 SW
C420 N1256 0 1n
E419 N1255 0 N1254 0 1
E420 N1257 0 N1256 0 1
S421 N1257 N1258 CP2_6 0 SW
C421 N1258 0 1n
S422 N1259 N1260 CP1_2 0 SW
C422 N1260 0 1n
E421 N1259 0 N1258 0 1
E422 N1261 0 N1260 0 1
S423 N1261 N1262 CP2_6 0 SW
C423 N1262 0 1n
S424 N1263 N1264 CP1_2 0 SW
C424 N1264 0 1n
E423 N1263 0 N1262 0 1
E424 N1185 0 N1264 0 1
S425 N1185 N1186 CP2_6 0 SW
C425 N1186 0 1n
S426 N1187 N1188 CP1_2 0 SW
C426 N1188 0 1n
E425 N1187 0 N1186 0 1
E426 N1189 0 N1188 0 1
S427 N1189 N1190 CP2_6 0 SW
C427 N1190 0 1n
S428 N1191 N1192 CP1_2 0 SW
C428 N1192 0 1n
E427 N1191 0 N1190 0 1
E428 N1193 0 N1192 0 1
S429 N1193 N1194 CP2_6 0 SW
C429 N1194 0 1n
S430 N1195 N1196 CP1_2 0 SW
C430 N1196 0 1n
E429 N1195 0 N1194 0 1
E430 N1197 0 N1196 0 1
S431 N1197 N1198 CP2_6 0 SW
C431 N1198 0 1n
S432 N1199 N1200 CP1_2 0 SW
C432 N1200 0 1n
E431 N1199 0 N1198 0 1
E432 N1121 0 N1200 0 1
S433 N1121 N1122 CP2_6 0 SW
C433 N1122 0 1n
S434 N1123 N1124 CP1_2 0 SW
C434 N1124 0 1n
E433 N1123 0 N1122 0 1
E434 N1125 0 N1124 0 1
S435 N1125 N1126 CP2_6 0 SW
C435 N1126 0 1n
S436 N1127 N1128 CP1_2 0 SW
C436 N1128 0 1n
E435 N1127 0 N1126 0 1
E436 N1129 0 N1128 0 1
S437 N1129 N1130 CP2_6 0 SW
C437 N1130 0 1n
S438 N1131 N1132 CP1_2 0 SW
C438 N1132 0 1n
E437 N1131 0 N1130 0 1
E438 N1133 0 N1132 0 1
S439 N1133 N1134 CP2_6 0 SW
C439 N1134 0 1n
S440 N1135 N1136 CP1_2 0 SW
C440 N1136 0 1n
E439 N1135 0 N1134 0 1
E440 N1056 0 N1136 0 1
S441 N1056 N1057 CP2_6 0 SW
C441 N1057 0 1n
S442 N1058 N1059 CP1_2 0 SW
C442 N1059 0 1n
E441 N1058 0 N1057 0 1
E442 N1060 0 N1059 0 1
S443 N1060 N1061 CP2_6 0 SW
C443 N1061 0 1n
S444 N1062 N1063 CP1_2 0 SW
C444 N1063 0 1n
E443 N1062 0 N1061 0 1
E444 N1064 0 N1063 0 1
S445 N1064 N1065 CP2_6 0 SW
C445 N1065 0 1n
S446 N1066 N1067 CP1_2 0 SW
C446 N1067 0 1n
E445 N1066 0 N1065 0 1
E446 N1068 0 N1067 0 1
S447 N1068 N1069 CP2_6 0 SW
C447 N1069 0 1n
S448 N1070 N1071 CP1_2 0 SW
C448 N1071 0 1n
E447 N1070 0 N1069 0 1
E448 N1072 0 N1071 0 1
S449 N1072 N1520 CP2_6 0 SW
C449 N1520 0 1n
S450 N1521 N1522 CP1_2 0 SW
C450 N1522 0 1n
E449 N1521 0 N1520 0 1
E450 N1523 0 N1522 0 1
S451 N1523 N1524 CP2_6 0 SW
C451 N1524 0 1n
S452 N1525 N1526 CP1_2 0 SW
C452 N1526 0 1n
E451 N1525 0 N1524 0 1
E452 N1527 0 N1526 0 1
S453 N1527 N1528 CP2_6 0 SW
C453 N1528 0 1n
S454 N1529 N1530 CP1_2 0 SW
C454 N1530 0 1n
E453 N1529 0 N1528 0 1
E454 N1531 0 N1530 0 1
S455 N1531 N1532 CP2_6 0 SW
C455 N1532 0 1n
S456 N1533 N1534 CP1_2 0 SW
C456 N1534 0 1n
E455 N1533 0 N1532 0 1
E456 N1457 0 N1534 0 1
S457 N1457 N1458 CP2_6 0 SW
C457 N1458 0 1n
S458 N1459 N1460 CP1_2 0 SW
C458 N1460 0 1n
E457 N1459 0 N1458 0 1
E458 N1461 0 N1460 0 1
S459 N1461 N1462 CP2_6 0 SW
C459 N1462 0 1n
S460 N1463 N1464 CP1_2 0 SW
C460 N1464 0 1n
E459 N1463 0 N1462 0 1
E460 N1465 0 N1464 0 1
S461 N1465 N1466 CP2_6 0 SW
C461 N1466 0 1n
S462 N1467 N1468 CP1_2 0 SW
C462 N1468 0 1n
E461 N1467 0 N1466 0 1
E462 N1469 0 N1468 0 1
S463 N1469 N1470 CP2_6 0 SW
C463 N1470 0 1n
S464 N1471 N1472 CP1_2 0 SW
C464 N1472 0 1n
E463 N1471 0 N1470 0 1
E464 N1393 0 N1472 0 1
S465 N1393 N1394 CP2_6 0 SW
C465 N1394 0 1n
S466 N1395 N1396 CP1_2 0 SW
C466 N1396 0 1n
E465 N1395 0 N1394 0 1
E466 N1397 0 N1396 0 1
S467 N1397 N1398 CP2_6 0 SW
C467 N1398 0 1n
S468 N1399 N1400 CP1_2 0 SW
C468 N1400 0 1n
E467 N1399 0 N1398 0 1
E468 N1401 0 N1400 0 1
S469 N1401 N1402 CP2_6 0 SW
C469 N1402 0 1n
S470 N1403 N1404 CP1_2 0 SW
C470 N1404 0 1n
E469 N1403 0 N1402 0 1
E470 N1405 0 N1404 0 1
S471 N1405 N1406 CP2_6 0 SW
C471 N1406 0 1n
S472 N1407 N1408 CP1_2 0 SW
C472 N1408 0 1n
E471 N1407 0 N1406 0 1
E472 N1329 0 N1408 0 1
S473 N1329 N1330 CP2_6 0 SW
C473 N1330 0 1n
S474 N1331 N1332 CP1_2 0 SW
C474 N1332 0 1n
E473 N1331 0 N1330 0 1
E474 N1333 0 N1332 0 1
S475 N1333 N1334 CP2_6 0 SW
C475 N1334 0 1n
S476 N1335 N1336 CP1_2 0 SW
C476 N1336 0 1n
E475 N1335 0 N1334 0 1
E476 N1337 0 N1336 0 1
S477 N1337 N1338 CP2_6 0 SW
C477 N1338 0 1n
S478 N1339 N1340 CP1_2 0 SW
C478 N1340 0 1n
E477 N1339 0 N1338 0 1
E478 N1341 0 N1340 0 1
S479 N1341 N1342 CP2_6 0 SW
C479 N1342 0 1n
S480 N1343 N1344 CP1_2 0 SW
C480 N1344 0 1n
E479 N1343 0 N1342 0 1
E480 N1265 0 N1344 0 1
S481 N1265 N1266 CP2_6 0 SW
C481 N1266 0 1n
S482 N1267 N1268 CP1_2 0 SW
C482 N1268 0 1n
E481 N1267 0 N1266 0 1
E482 N1269 0 N1268 0 1
S483 N1269 N1270 CP2_6 0 SW
C483 N1270 0 1n
S484 N1271 N1272 CP1_2 0 SW
C484 N1272 0 1n
E483 N1271 0 N1270 0 1
E484 N1273 0 N1272 0 1
S485 N1273 N1274 CP2_6 0 SW
C485 N1274 0 1n
S486 N1275 N1276 CP1_2 0 SW
C486 N1276 0 1n
E485 N1275 0 N1274 0 1
E486 N1277 0 N1276 0 1
S487 N1277 N1278 CP2_6 0 SW
C487 N1278 0 1n
S488 N1279 N1280 CP1_2 0 SW
C488 N1280 0 1n
E487 N1279 0 N1278 0 1
E488 N1201 0 N1280 0 1
S489 N1201 N1202 CP2_6 0 SW
C489 N1202 0 1n
S490 N1203 N1204 CP1_2 0 SW
C490 N1204 0 1n
E489 N1203 0 N1202 0 1
E490 N1205 0 N1204 0 1
S491 N1205 N1206 CP2_6 0 SW
C491 N1206 0 1n
S492 N1207 N1208 CP1_2 0 SW
C492 N1208 0 1n
E491 N1207 0 N1206 0 1
E492 N1209 0 N1208 0 1
S493 N1209 N1210 CP2_6 0 SW
C493 N1210 0 1n
S494 N1211 N1212 CP1_2 0 SW
C494 N1212 0 1n
E493 N1211 0 N1210 0 1
E494 N1213 0 N1212 0 1
S495 N1213 N1214 CP2_6 0 SW
C495 N1214 0 1n
S496 N1215 N1216 CP1_2 0 SW
C496 N1216 0 1n
E495 N1215 0 N1214 0 1
E496 N1137 0 N1216 0 1
S497 N1137 N1138 CP2_6 0 SW
C497 N1138 0 1n
S498 N1139 N1140 CP1_2 0 SW
C498 N1140 0 1n
E497 N1139 0 N1138 0 1
E498 N1141 0 N1140 0 1
S499 N1141 N1142 CP2_6 0 SW
C499 N1142 0 1n
S500 N1143 N1144 CP1_2 0 SW
C500 N1144 0 1n
E499 N1143 0 N1142 0 1
E500 N1145 0 N1144 0 1
S501 N1145 N1146 CP2_6 0 SW
C501 N1146 0 1n
S502 N1147 N1148 CP1_2 0 SW
C502 N1148 0 1n
E501 N1147 0 N1146 0 1
E502 N1149 0 N1148 0 1
S503 N1149 N1150 CP2_6 0 SW
C503 N1150 0 1n
S504 N1151 N1152 CP1_2 0 SW
C504 N1152 0 1n
E503 N1151 0 N1150 0 1
E504 N1073 0 N1152 0 1
S505 N1073 N1074 CP2_6 0 SW
C505 N1074 0 1n
S506 N1075 N1076 CP1_2 0 SW
C506 N1076 0 1n
E505 N1075 0 N1074 0 1
E506 N1077 0 N1076 0 1
S507 N1077 N1078 CP2_6 0 SW
C507 N1078 0 1n
S508 N1079 N1080 CP1_2 0 SW
C508 N1080 0 1n
E507 N1079 0 N1078 0 1
E508 N1081 0 N1080 0 1
S509 N1081 N1082 CP2_6 0 SW
C509 N1082 0 1n
S510 N1083 N1084 CP1_2 0 SW
C510 N1084 0 1n
E509 N1083 0 N1082 0 1
E510 N1085 0 N1084 0 1
S511 N1085 N1086 CP2_6 0 SW
C511 N1086 0 1n
S512 N1087 N1088 CP1_2 0 SW
C512 N1088 0 1n
E511 N1087 0 N1086 0 1
E512 A 0 N1088 0 1
S513 A N962 CP2_6 0 SW
C513 N962 0 1n
S514 N963 N964 CP1_2 0 SW
C514 N964 0 1n
E513 N963 0 N962 0 1
E514 N965 0 N964 0 1
S515 N965 N966 CP2_6 0 SW
C515 N966 0 1n
S516 N967 N968 CP1_2 0 SW
C516 N968 0 1n
E515 N967 0 N966 0 1
E516 N969 0 N968 0 1
S517 N969 N970 CP2_6 0 SW
C517 N970 0 1n
S518 N971 N972 CP1_2 0 SW
C518 N972 0 1n
E517 N971 0 N970 0 1
E518 N973 0 N972 0 1
S519 N973 N974 CP2_6 0 SW
C519 N974 0 1n
S520 N975 N976 CP1_2 0 SW
C520 N976 0 1n
E519 N975 0 N974 0 1
E520 N898 0 N976 0 1
S521 N898 N899 CP2_6 0 SW
C521 N899 0 1n
S522 N900 N901 CP1_2 0 SW
C522 N901 0 1n
E521 N900 0 N899 0 1
E522 N902 0 N901 0 1
S523 N902 N903 CP2_6 0 SW
C523 N903 0 1n
S524 N904 N905 CP1_2 0 SW
C524 N905 0 1n
E523 N904 0 N903 0 1
E524 N906 0 N905 0 1
S525 N906 N907 CP2_6 0 SW
C525 N907 0 1n
S526 N908 N909 CP1_2 0 SW
C526 N909 0 1n
E525 N908 0 N907 0 1
E526 N910 0 N909 0 1
S527 N910 N911 CP2_6 0 SW
C527 N911 0 1n
S528 N912 N913 CP1_2 0 SW
C528 N913 0 1n
E527 N912 0 N911 0 1
E528 N834 0 N913 0 1
S529 N834 N835 CP2_6 0 SW
C529 N835 0 1n
S530 N836 N837 CP1_2 0 SW
C530 N837 0 1n
E529 N836 0 N835 0 1
E530 N838 0 N837 0 1
S531 N838 N839 CP2_6 0 SW
C531 N839 0 1n
S532 N840 N841 CP1_2 0 SW
C532 N841 0 1n
E531 N840 0 N839 0 1
E532 N842 0 N841 0 1
S533 N842 N843 CP2_6 0 SW
C533 N843 0 1n
S534 N844 N845 CP1_2 0 SW
C534 N845 0 1n
E533 N844 0 N843 0 1
E534 N846 0 N845 0 1
S535 N846 N847 CP2_6 0 SW
C535 N847 0 1n
S536 N848 N849 CP1_2 0 SW
C536 N849 0 1n
E535 N848 0 N847 0 1
E536 N770 0 N849 0 1
S537 N770 N771 CP2_6 0 SW
C537 N771 0 1n
S538 N772 N773 CP1_2 0 SW
C538 N773 0 1n
E537 N772 0 N771 0 1
E538 N774 0 N773 0 1
S539 N774 N775 CP2_6 0 SW
C539 N775 0 1n
S540 N776 N777 CP1_2 0 SW
C540 N777 0 1n
E539 N776 0 N775 0 1
E540 N778 0 N777 0 1
S541 N778 N779 CP2_6 0 SW
C541 N779 0 1n
S542 N780 N781 CP1_2 0 SW
C542 N781 0 1n
E541 N780 0 N779 0 1
E542 N782 0 N781 0 1
S543 N782 N783 CP2_6 0 SW
C543 N783 0 1n
S544 N784 N785 CP1_2 0 SW
C544 N785 0 1n
E543 N784 0 N783 0 1
E544 N706 0 N785 0 1
S545 N706 N707 CP2_6 0 SW
C545 N707 0 1n
S546 N708 N709 CP1_2 0 SW
C546 N709 0 1n
E545 N708 0 N707 0 1
E546 N710 0 N709 0 1
S547 N710 N711 CP2_6 0 SW
C547 N711 0 1n
S548 N712 N713 CP1_2 0 SW
C548 N713 0 1n
E547 N712 0 N711 0 1
E548 N714 0 N713 0 1
S549 N714 N715 CP2_6 0 SW
C549 N715 0 1n
S550 N716 N717 CP1_2 0 SW
C550 N717 0 1n
E549 N716 0 N715 0 1
E550 N718 0 N717 0 1
S551 N718 N719 CP2_6 0 SW
C551 N719 0 1n
S552 N720 N721 CP1_2 0 SW
C552 N721 0 1n
E551 N720 0 N719 0 1
E552 N642 0 N721 0 1
S553 N642 N643 CP2_6 0 SW
C553 N643 0 1n
S554 N644 N645 CP1_2 0 SW
C554 N645 0 1n
E553 N644 0 N643 0 1
E554 N646 0 N645 0 1
S555 N646 N647 CP2_6 0 SW
C555 N647 0 1n
S556 N648 N649 CP1_2 0 SW
C556 N649 0 1n
E555 N648 0 N647 0 1
E556 N650 0 N649 0 1
S557 N650 N651 CP2_6 0 SW
C557 N651 0 1n
S558 N652 N653 CP1_2 0 SW
C558 N653 0 1n
E557 N652 0 N651 0 1
E558 N654 0 N653 0 1
S559 N654 N655 CP2_6 0 SW
C559 N655 0 1n
S560 N656 N657 CP1_2 0 SW
C560 N657 0 1n
E559 N656 0 N655 0 1
E560 N578 0 N657 0 1
S561 N578 N579 CP2_6 0 SW
C561 N579 0 1n
S562 N580 N581 CP1_2 0 SW
C562 N581 0 1n
E561 N580 0 N579 0 1
E562 N582 0 N581 0 1
S563 N582 N583 CP2_6 0 SW
C563 N583 0 1n
S564 N584 N585 CP1_2 0 SW
C564 N585 0 1n
E563 N584 0 N583 0 1
E564 N586 0 N585 0 1
S565 N586 N587 CP2_6 0 SW
C565 N587 0 1n
S566 N588 N589 CP1_2 0 SW
C566 N589 0 1n
E565 N588 0 N587 0 1
E566 N590 0 N589 0 1
S567 N590 N591 CP2_6 0 SW
C567 N591 0 1n
S568 N592 N593 CP1_2 0 SW
C568 N593 0 1n
E567 N592 0 N591 0 1
E568 N512 0 N593 0 1
S569 N512 N513 CP2_6 0 SW
C569 N513 0 1n
S570 N514 N515 CP1_2 0 SW
C570 N515 0 1n
E569 N514 0 N513 0 1
E570 N516 0 N515 0 1
S571 N516 N517 CP2_6 0 SW
C571 N517 0 1n
S572 N518 N519 CP1_2 0 SW
C572 N519 0 1n
E571 N518 0 N517 0 1
E572 N520 0 N519 0 1
S573 N520 N521 CP2_6 0 SW
C573 N521 0 1n
S574 N522 N523 CP1_2 0 SW
C574 N523 0 1n
E573 N522 0 N521 0 1
E574 N524 0 N523 0 1
S575 N524 N525 CP2_6 0 SW
C575 N525 0 1n
S576 N526 N527 CP1_2 0 SW
C576 N527 0 1n
E575 N526 0 N525 0 1
E576 N528 0 N527 0 1
S577 N528 N977 CP2_6 0 SW
C577 N977 0 1n
S578 N978 N979 CP1_2 0 SW
C578 N979 0 1n
E577 N978 0 N977 0 1
E578 N980 0 N979 0 1
S579 N980 N981 CP2_6 0 SW
C579 N981 0 1n
S580 N982 N983 CP1_2 0 SW
C580 N983 0 1n
E579 N982 0 N981 0 1
E580 N984 0 N983 0 1
S581 N984 N985 CP2_6 0 SW
C581 N985 0 1n
S582 N986 N987 CP1_2 0 SW
C582 N987 0 1n
E581 N986 0 N985 0 1
E582 N988 0 N987 0 1
S583 N988 N989 CP2_6 0 SW
C583 N989 0 1n
S584 N990 N991 CP1_2 0 SW
C584 N991 0 1n
E583 N990 0 N989 0 1
E584 N914 0 N991 0 1
S585 N914 N915 CP2_6 0 SW
C585 N915 0 1n
S586 N916 N917 CP1_2 0 SW
C586 N917 0 1n
E585 N916 0 N915 0 1
E586 N918 0 N917 0 1
S587 N918 N919 CP2_6 0 SW
C587 N919 0 1n
S588 N920 N921 CP1_2 0 SW
C588 N921 0 1n
E587 N920 0 N919 0 1
E588 N922 0 N921 0 1
S589 N922 N923 CP2_6 0 SW
C589 N923 0 1n
S590 N924 N925 CP1_2 0 SW
C590 N925 0 1n
E589 N924 0 N923 0 1
E590 N926 0 N925 0 1
S591 N926 N927 CP2_6 0 SW
C591 N927 0 1n
S592 N928 N929 CP1_2 0 SW
C592 N929 0 1n
E591 N928 0 N927 0 1
E592 N850 0 N929 0 1
S593 N850 N851 CP2_6 0 SW
C593 N851 0 1n
S594 N852 N853 CP1_2 0 SW
C594 N853 0 1n
E593 N852 0 N851 0 1
E594 N854 0 N853 0 1
S595 N854 N855 CP2_6 0 SW
C595 N855 0 1n
S596 N856 N857 CP1_2 0 SW
C596 N857 0 1n
E595 N856 0 N855 0 1
E596 N858 0 N857 0 1
S597 N858 N859 CP2_6 0 SW
C597 N859 0 1n
S598 N860 N861 CP1_2 0 SW
C598 N861 0 1n
E597 N860 0 N859 0 1
E598 N862 0 N861 0 1
S599 N862 N863 CP2_6 0 SW
C599 N863 0 1n
S600 N864 N865 CP1_2 0 SW
C600 N865 0 1n
E599 N864 0 N863 0 1
E600 N786 0 N865 0 1
S601 N786 N787 CP2_6 0 SW
C601 N787 0 1n
S602 N788 N789 CP1_2 0 SW
C602 N789 0 1n
E601 N788 0 N787 0 1
E602 N790 0 N789 0 1
S603 N790 N791 CP2_6 0 SW
C603 N791 0 1n
S604 N792 N793 CP1_2 0 SW
C604 N793 0 1n
E603 N792 0 N791 0 1
E604 N794 0 N793 0 1
S605 N794 N795 CP2_6 0 SW
C605 N795 0 1n
S606 N796 N797 CP1_2 0 SW
C606 N797 0 1n
E605 N796 0 N795 0 1
E606 N798 0 N797 0 1
S607 N798 N799 CP2_6 0 SW
C607 N799 0 1n
S608 N800 N801 CP1_2 0 SW
C608 N801 0 1n
E607 N800 0 N799 0 1
E608 N722 0 N801 0 1
S609 N722 N723 CP2_6 0 SW
C609 N723 0 1n
S610 N724 N725 CP1_2 0 SW
C610 N725 0 1n
E609 N724 0 N723 0 1
E610 N726 0 N725 0 1
S611 N726 N727 CP2_6 0 SW
C611 N727 0 1n
S612 N728 N729 CP1_2 0 SW
C612 N729 0 1n
E611 N728 0 N727 0 1
E612 N730 0 N729 0 1
S613 N730 N731 CP2_6 0 SW
C613 N731 0 1n
S614 N732 N733 CP1_2 0 SW
C614 N733 0 1n
E613 N732 0 N731 0 1
E614 N734 0 N733 0 1
S615 N734 N735 CP2_6 0 SW
C615 N735 0 1n
S616 N736 N737 CP1_2 0 SW
C616 N737 0 1n
E615 N736 0 N735 0 1
E616 N658 0 N737 0 1
S617 N658 N659 CP2_6 0 SW
C617 N659 0 1n
S618 N660 N661 CP1_2 0 SW
C618 N661 0 1n
E617 N660 0 N659 0 1
E618 N662 0 N661 0 1
S619 N662 N663 CP2_6 0 SW
C619 N663 0 1n
S620 N664 N665 CP1_2 0 SW
C620 N665 0 1n
E619 N664 0 N663 0 1
E620 N666 0 N665 0 1
S621 N666 N667 CP2_6 0 SW
C621 N667 0 1n
S622 N668 N669 CP1_2 0 SW
C622 N669 0 1n
E621 N668 0 N667 0 1
E622 N670 0 N669 0 1
S623 N670 N671 CP2_6 0 SW
C623 N671 0 1n
S624 N672 N673 CP1_2 0 SW
C624 N673 0 1n
E623 N672 0 N671 0 1
E624 N594 0 N673 0 1
S625 N594 N595 CP2_6 0 SW
C625 N595 0 1n
S626 N596 N597 CP1_2 0 SW
C626 N597 0 1n
E625 N596 0 N595 0 1
E626 N598 0 N597 0 1
S627 N598 N599 CP2_6 0 SW
C627 N599 0 1n
S628 N600 N601 CP1_2 0 SW
C628 N601 0 1n
E627 N600 0 N599 0 1
E628 N602 0 N601 0 1
S629 N602 N603 CP2_6 0 SW
C629 N603 0 1n
S630 N604 N605 CP1_2 0 SW
C630 N605 0 1n
E629 N604 0 N603 0 1
E630 N606 0 N605 0 1
S631 N606 N607 CP2_6 0 SW
C631 N607 0 1n
S632 N608 N609 CP1_2 0 SW
C632 N609 0 1n
E631 N608 0 N607 0 1
E632 N529 0 N609 0 1
S633 N529 N530 CP2_6 0 SW
C633 N530 0 1n
S634 N531 N532 CP1_2 0 SW
C634 N532 0 1n
E633 N531 0 N530 0 1
E634 N533 0 N532 0 1
S635 N533 N534 CP2_6 0 SW
C635 N534 0 1n
S636 N535 N536 CP1_2 0 SW
C636 N536 0 1n
E635 N535 0 N534 0 1
E636 N537 0 N536 0 1
S637 N537 N538 CP2_6 0 SW
C637 N538 0 1n
S638 N539 N540 CP1_2 0 SW
C638 N540 0 1n
E637 N539 0 N538 0 1
E638 N541 0 N540 0 1
S639 N541 N542 CP2_6 0 SW
C639 N542 0 1n
S640 N543 N544 CP1_2 0 SW
C640 N544 0 1n
E639 N543 0 N542 0 1
E640 N450 0 N544 0 1
S641 N450 N451 CP2_6 0 SW
C641 N451 0 1n
S642 N452 N453 CP1_2 0 SW
C642 N453 0 1n
E641 N452 0 N451 0 1
E642 N454 0 N453 0 1
S643 N454 N455 CP2_6 0 SW
C643 N455 0 1n
S644 N456 N457 CP1_2 0 SW
C644 N457 0 1n
E643 N456 0 N455 0 1
E644 N458 0 N457 0 1
S645 N458 N459 CP2_6 0 SW
C645 N459 0 1n
S646 N460 N461 CP1_2 0 SW
C646 N461 0 1n
E645 N460 0 N459 0 1
E646 N462 0 N461 0 1
S647 N462 N463 CP2_6 0 SW
C647 N463 0 1n
S648 N464 N465 CP1_2 0 SW
C648 N465 0 1n
E647 N464 0 N463 0 1
E648 N386 0 N465 0 1
S649 N386 N387 CP2_6 0 SW
C649 N387 0 1n
S650 N388 N389 CP1_2 0 SW
C650 N389 0 1n
E649 N388 0 N387 0 1
E650 N390 0 N389 0 1
S651 N390 N391 CP2_6 0 SW
C651 N391 0 1n
S652 N392 N393 CP1_2 0 SW
C652 N393 0 1n
E651 N392 0 N391 0 1
E652 N394 0 N393 0 1
S653 N394 N395 CP2_6 0 SW
C653 N395 0 1n
S654 N396 N397 CP1_2 0 SW
C654 N397 0 1n
E653 N396 0 N395 0 1
E654 N398 0 N397 0 1
S655 N398 N399 CP2_6 0 SW
C655 N399 0 1n
S656 N400 N401 CP1_2 0 SW
C656 N401 0 1n
E655 N400 0 N399 0 1
E656 N322 0 N401 0 1
S657 N322 N323 CP2_6 0 SW
C657 N323 0 1n
S658 N324 N325 CP1_2 0 SW
C658 N325 0 1n
E657 N324 0 N323 0 1
E658 N326 0 N325 0 1
S659 N326 N327 CP2_6 0 SW
C659 N327 0 1n
S660 N328 N329 CP1_2 0 SW
C660 N329 0 1n
E659 N328 0 N327 0 1
E660 N330 0 N329 0 1
S661 N330 N331 CP2_6 0 SW
C661 N331 0 1n
S662 N332 N333 CP1_2 0 SW
C662 N333 0 1n
E661 N332 0 N331 0 1
E662 N334 0 N333 0 1
S663 N334 N335 CP2_6 0 SW
C663 N335 0 1n
S664 N336 N337 CP1_2 0 SW
C664 N337 0 1n
E663 N336 0 N335 0 1
E664 N258 0 N337 0 1
S665 N258 N259 CP2_6 0 SW
C665 N259 0 1n
S666 N260 N261 CP1_2 0 SW
C666 N261 0 1n
E665 N260 0 N259 0 1
E666 N262 0 N261 0 1
S667 N262 N263 CP2_6 0 SW
C667 N263 0 1n
S668 N264 N265 CP1_2 0 SW
C668 N265 0 1n
E667 N264 0 N263 0 1
E668 N266 0 N265 0 1
S669 N266 N267 CP2_6 0 SW
C669 N267 0 1n
S670 N268 N269 CP1_2 0 SW
C670 N269 0 1n
E669 N268 0 N267 0 1
E670 N270 0 N269 0 1
S671 N270 N271 CP2_6 0 SW
C671 N271 0 1n
S672 N272 N273 CP1_2 0 SW
C672 N273 0 1n
E671 N272 0 N271 0 1
E672 N194 0 N273 0 1
S673 N194 N195 CP2_6 0 SW
C673 N195 0 1n
S674 N196 N197 CP1_2 0 SW
C674 N197 0 1n
E673 N196 0 N195 0 1
E674 N198 0 N197 0 1
S675 N198 N199 CP2_6 0 SW
C675 N199 0 1n
S676 N200 N201 CP1_2 0 SW
C676 N201 0 1n
E675 N200 0 N199 0 1
E676 N202 0 N201 0 1
S677 N202 N203 CP2_6 0 SW
C677 N203 0 1n
S678 N204 N205 CP1_2 0 SW
C678 N205 0 1n
E677 N204 0 N203 0 1
E678 N206 0 N205 0 1
S679 N206 N207 CP2_6 0 SW
C679 N207 0 1n
S680 N208 N209 CP1_2 0 SW
C680 N209 0 1n
E679 N208 0 N207 0 1
E680 N130 0 N209 0 1
S681 N130 N131 CP2_6 0 SW
C681 N131 0 1n
S682 N132 N133 CP1_2 0 SW
C682 N133 0 1n
E681 N132 0 N131 0 1
E682 N134 0 N133 0 1
S683 N134 N135 CP2_6 0 SW
C683 N135 0 1n
S684 N136 N137 CP1_2 0 SW
C684 N137 0 1n
E683 N136 0 N135 0 1
E684 N138 0 N137 0 1
S685 N138 N139 CP2_6 0 SW
C685 N139 0 1n
S686 N140 N141 CP1_2 0 SW
C686 N141 0 1n
E685 N140 0 N139 0 1
E686 N142 0 N141 0 1
S687 N142 N143 CP2_6 0 SW
C687 N143 0 1n
S688 N144 N145 CP1_2 0 SW
C688 N145 0 1n
E687 N144 0 N143 0 1
E688 N066 0 N145 0 1
S689 N066 N067 CP2_6 0 SW
C689 N067 0 1n
S690 N068 N069 CP1_2 0 SW
C690 N069 0 1n
E689 N068 0 N067 0 1
E690 N070 0 N069 0 1
S691 N070 N071 CP2_6 0 SW
C691 N071 0 1n
S692 N072 N073 CP1_2 0 SW
C692 N073 0 1n
E691 N072 0 N071 0 1
E692 N074 0 N073 0 1
S693 N074 N075 CP2_6 0 SW
C693 N075 0 1n
S694 N076 N077 CP1_2 0 SW
C694 N077 0 1n
E693 N076 0 N075 0 1
E694 N078 0 N077 0 1
S695 N078 N079 CP2_6 0 SW
C695 N079 0 1n
S696 N080 N081 CP1_2 0 SW
C696 N081 0 1n
E695 N080 0 N079 0 1
E696 N001 0 N081 0 1
S697 N001 N002 CP2_6 0 SW
C697 N002 0 1n
S698 N003 N004 CP1_2 0 SW
C698 N004 0 1n
E697 N003 0 N002 0 1
E698 N005 0 N004 0 1
S699 N005 N006 CP2_6 0 SW
C699 N006 0 1n
S700 N007 N008 CP1_2 0 SW
C700 N008 0 1n
E699 N007 0 N006 0 1
E700 N009 0 N008 0 1
S701 N009 N010 CP2_6 0 SW
C701 N010 0 1n
S702 N011 N012 CP1_2 0 SW
C702 N012 0 1n
E701 N011 0 N010 0 1
E702 N013 0 N012 0 1
S703 N013 N014 CP2_6 0 SW
C703 N014 0 1n
S704 N015 N016 CP1_2 0 SW
C704 N016 0 1n
E703 N015 0 N014 0 1
E704 N017 0 N016 0 1
S705 N017 N466 CP2_6 0 SW
C705 N466 0 1n
S706 N467 N468 CP1_2 0 SW
C706 N468 0 1n
E705 N467 0 N466 0 1
E706 N469 0 N468 0 1
S707 N469 N470 CP2_6 0 SW
C707 N470 0 1n
S708 N471 N472 CP1_2 0 SW
C708 N472 0 1n
E707 N471 0 N470 0 1
E708 N473 0 N472 0 1
S709 N473 N474 CP2_6 0 SW
C709 N474 0 1n
S710 N475 N476 CP1_2 0 SW
C710 N476 0 1n
E709 N475 0 N474 0 1
E710 N477 0 N476 0 1
S711 N477 N478 CP2_6 0 SW
C711 N478 0 1n
S712 N479 N480 CP1_2 0 SW
C712 N480 0 1n
E711 N479 0 N478 0 1
E712 N402 0 N480 0 1
S713 N402 N403 CP2_6 0 SW
C713 N403 0 1n
S714 N404 N405 CP1_2 0 SW
C714 N405 0 1n
E713 N404 0 N403 0 1
E714 N406 0 N405 0 1
S715 N406 N407 CP2_6 0 SW
C715 N407 0 1n
S716 N408 N409 CP1_2 0 SW
C716 N409 0 1n
E715 N408 0 N407 0 1
E716 N410 0 N409 0 1
S717 N410 N411 CP2_6 0 SW
C717 N411 0 1n
S718 N412 N413 CP1_2 0 SW
C718 N413 0 1n
E717 N412 0 N411 0 1
E718 N414 0 N413 0 1
S719 N414 N415 CP2_6 0 SW
C719 N415 0 1n
S720 N416 N417 CP1_2 0 SW
C720 N417 0 1n
E719 N416 0 N415 0 1
E720 N338 0 N417 0 1
S721 N338 N339 CP2_6 0 SW
C721 N339 0 1n
S722 N340 N341 CP1_2 0 SW
C722 N341 0 1n
E721 N340 0 N339 0 1
E722 N342 0 N341 0 1
S723 N342 N343 CP2_6 0 SW
C723 N343 0 1n
S724 N344 N345 CP1_2 0 SW
C724 N345 0 1n
E723 N344 0 N343 0 1
E724 N346 0 N345 0 1
S725 N346 N347 CP2_6 0 SW
C725 N347 0 1n
S726 N348 N349 CP1_2 0 SW
C726 N349 0 1n
E725 N348 0 N347 0 1
E726 N350 0 N349 0 1
S727 N350 N351 CP2_6 0 SW
C727 N351 0 1n
S728 N352 N353 CP1_2 0 SW
C728 N353 0 1n
E727 N352 0 N351 0 1
E728 N274 0 N353 0 1
S729 N274 N275 CP2_6 0 SW
C729 N275 0 1n
S730 N276 N277 CP1_2 0 SW
C730 N277 0 1n
E729 N276 0 N275 0 1
E730 N278 0 N277 0 1
S731 N278 N279 CP2_6 0 SW
C731 N279 0 1n
S732 N280 N281 CP1_2 0 SW
C732 N281 0 1n
E731 N280 0 N279 0 1
E732 N282 0 N281 0 1
S733 N282 N283 CP2_6 0 SW
C733 N283 0 1n
S734 N284 N285 CP1_2 0 SW
C734 N285 0 1n
E733 N284 0 N283 0 1
E734 N286 0 N285 0 1
S735 N286 N287 CP2_6 0 SW
C735 N287 0 1n
S736 N288 N289 CP1_2 0 SW
C736 N289 0 1n
E735 N288 0 N287 0 1
E736 N210 0 N289 0 1
S737 N210 N211 CP2_6 0 SW
C737 N211 0 1n
S738 N212 N213 CP1_2 0 SW
C738 N213 0 1n
E737 N212 0 N211 0 1
E738 N214 0 N213 0 1
S739 N214 N215 CP2_6 0 SW
C739 N215 0 1n
S740 N216 N217 CP1_2 0 SW
C740 N217 0 1n
E739 N216 0 N215 0 1
E740 N218 0 N217 0 1
S741 N218 N219 CP2_6 0 SW
C741 N219 0 1n
S742 N220 N221 CP1_2 0 SW
C742 N221 0 1n
E741 N220 0 N219 0 1
E742 N222 0 N221 0 1
S743 N222 N223 CP2_6 0 SW
C743 N223 0 1n
S744 N224 N225 CP1_2 0 SW
C744 N225 0 1n
E743 N224 0 N223 0 1
E744 N146 0 N225 0 1
S745 N146 N147 CP2_6 0 SW
C745 N147 0 1n
S746 N148 N149 CP1_2 0 SW
C746 N149 0 1n
E745 N148 0 N147 0 1
E746 N150 0 N149 0 1
S747 N150 N151 CP2_6 0 SW
C747 N151 0 1n
S748 N152 N153 CP1_2 0 SW
C748 N153 0 1n
E747 N152 0 N151 0 1
E748 N154 0 N153 0 1
S749 N154 N155 CP2_6 0 SW
C749 N155 0 1n